# EAGLE design board (EAGLE 5.11)

## Sheet 1 of 4
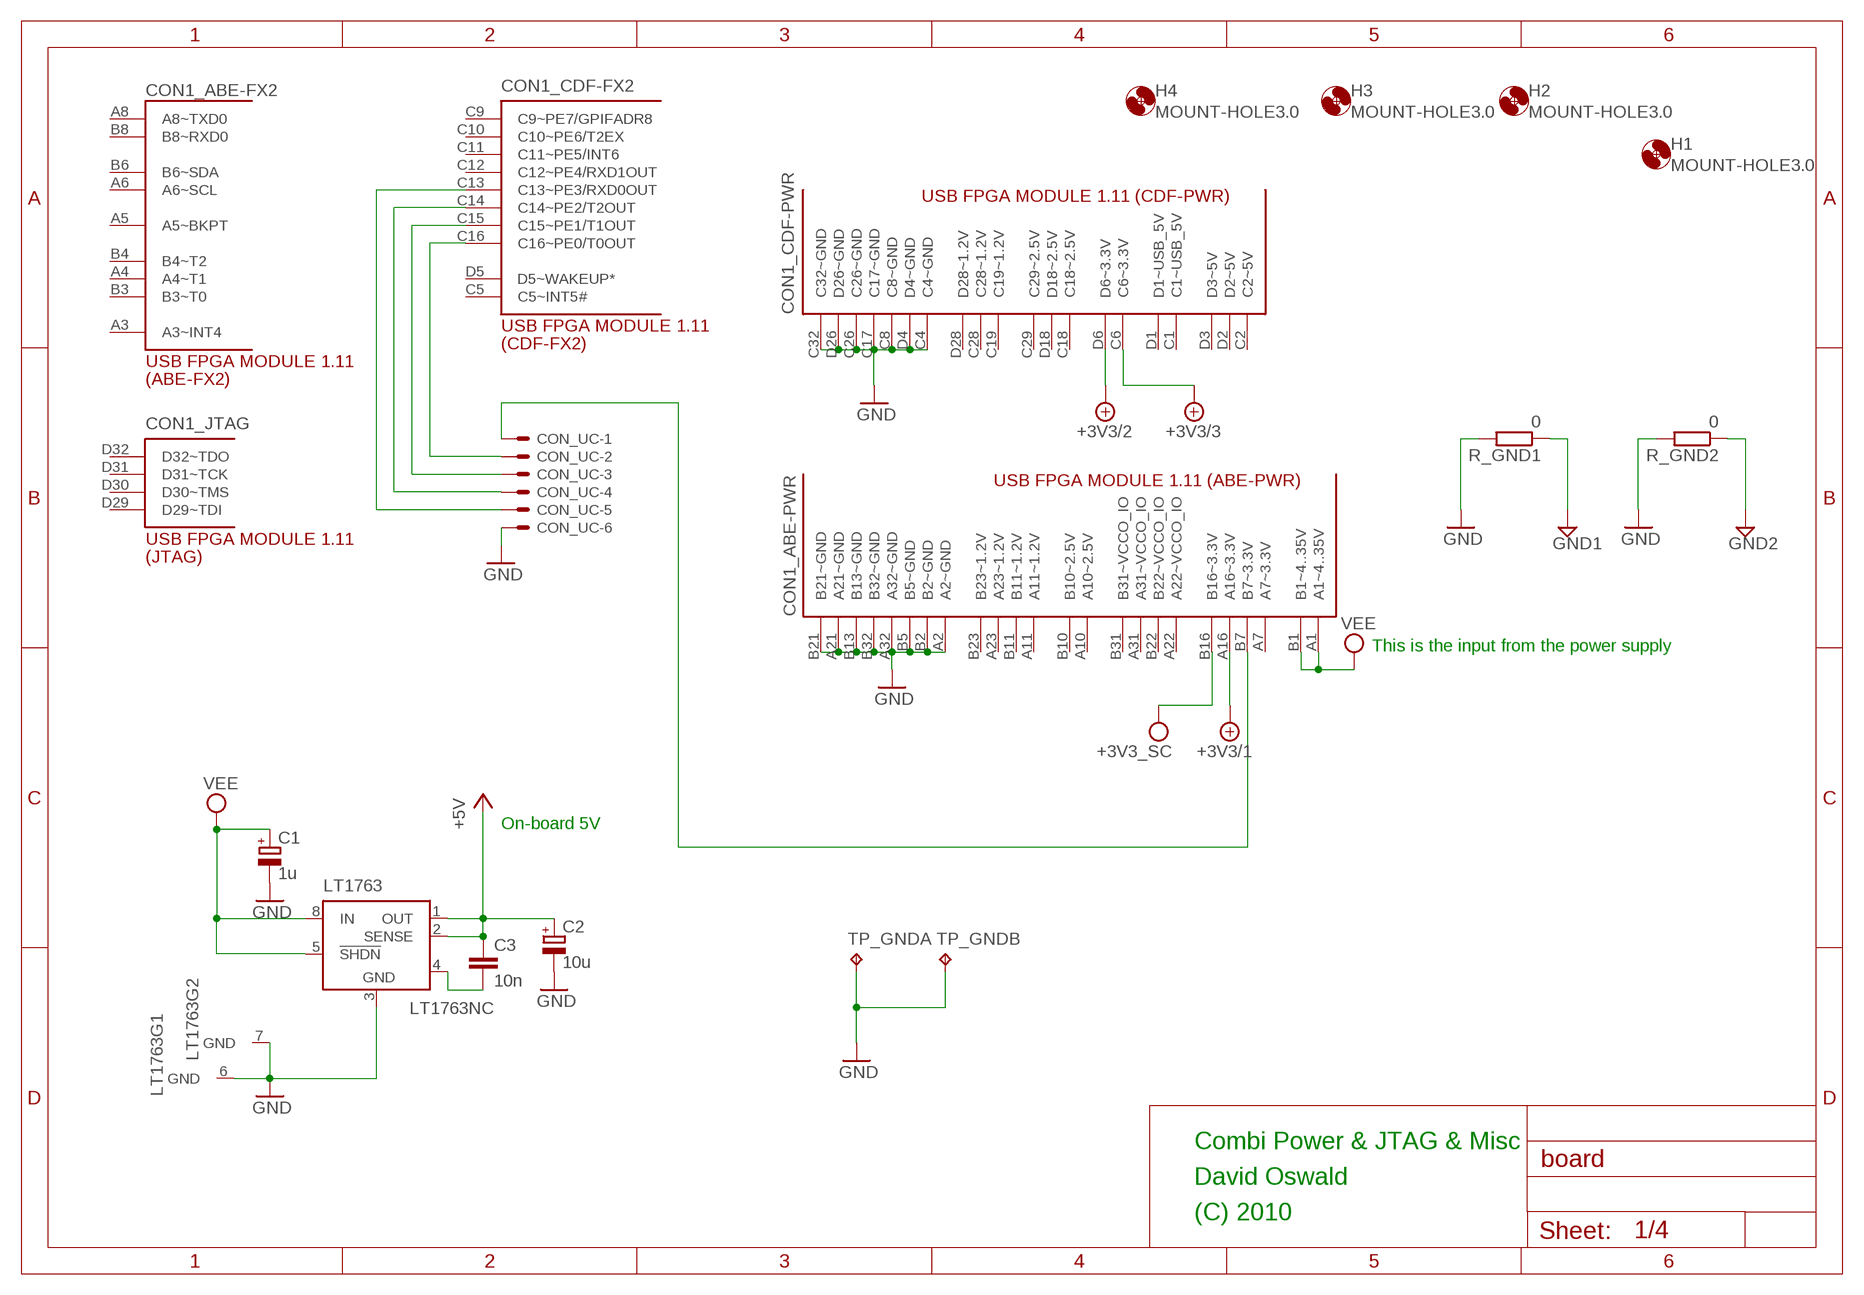
[diagram p0: schematic, sheet 1]

### Parts
C1  1u  CPOL-EUSMCC  [SMC_C]
C2  10u  CPOL-EUSMCC  [SMC_C]
C3  10n  C-EUC1206  [C1206]
CON1  USB-FPGA1.11  [USB-FPGA1.11]
CON_UC  22-23-2061  [22-23-2061]
H1  MOUNT-HOLE3.0  [3,0]
H2  MOUNT-HOLE3.0  [3,0]
H3  MOUNT-HOLE3.0  [3,0]
H4  MOUNT-HOLE3.0  [3,0]
LT1763  LT1129CS8  [SOIC8]
R_GND1  0  R-EU_R1206  [R1206]
R_GND2  0  R-EU_R1206  [R1206]
TP_GNDA  TPPAD1-13  [P1-13]
TP_GNDB  TPPAD1-13  [P1-13]

### Nets
+5V: C2.+ C3.1 LT1763.1(OUT) LT1763.2(SENSE) ; also sheet 2
+5V/1: CON1.A16(_ABE-PWR:A16~3.3V) ; supply symbol labelled +3V3/1 ; also sheet 2
+5V/2: CON1.D6(_CDF-PWR:D6~3.3V) ; supply symbol labelled +3V3/2 ; also sheet 3
+5V/3: CON1.C6(_CDF-PWR:C6~3.3V) ; supply symbol labelled +3V3/3 ; also sheet 3
GND: C1.- C2.- CON1.A2(_ABE-PWR:A2~GND) CON1.A21(_ABE-PWR:A21~GND) CON1.A32(_ABE-PWR:A32~GND) CON1.B2(_ABE-PWR:B2~GND) CON1.B5(_ABE-PWR:B5~GND) CON1.B13(_ABE-PWR:B13~GND) CON1.B21(_ABE-PWR:B21~GND) CON1.B32(_ABE-PWR:B32~GND) CON1.C4(_CDF-PWR:C4~GND) CON1.C8(_CDF-PWR:C8~GND) CON1.C17(_CDF-PWR:C17~GND) CON1.C26(_CDF-PWR:C26~GND) CON1.C32(_CDF-PWR:C32~GND) CON1.D4(_CDF-PWR:D4~GND) CON1.D26(_CDF-PWR:D26~GND) CON_UC.6 LT1763.3(GND) LT1763.6(GND) LT1763.7(GND) R_GND1.2 R_GND2.2 TP_GNDA.TP TP_GNDB.TP ; also sheet 2,3,4
GND1: R_GND1.1 ; also sheet 2
GND2: R_GND2.1 ; also sheet 3
N$7: C3.2 LT1763.4(NC)
N$58: CON1.B7(_ABE-PWR:B7~3.3V) CON_UC.1
N$60: CON1.C13(_CDF-FX2:C13~PE3/RXD0OUT) CON_UC.5
N$61: CON1.C14(_CDF-FX2:C14~PE2/T2OUT) CON_UC.4
N$62: CON1.C15(_CDF-FX2:C15~PE1/T1OUT) CON_UC.3
N$63: CON1.C16(_CDF-FX2:C16~PE0/T0OUT) CON_UC.2
VEE: C1.+ CON1.A1(_ABE-PWR:A1~4..35V) CON1.B1(_ABE-PWR:B1~4..35V) LT1763.5(!SHDN) LT1763.8(IN)
VPP: CON1.B16(_ABE-PWR:B16~3.3V) ; supply symbol labelled +3V3_SC ; also sheet 4
Unconnected: CON1.A3(_ABE-FX2:A3~INT4) CON1.A4(_ABE-FX2:A4~T1) CON1.A5(_ABE-FX2:A5~BKPT) CON1.A6(_ABE-FX2:A6~SCL) CON1.A7(_ABE-PWR:A7~3.3V) CON1.A8(_ABE-FX2:A8~TXD0) CON1.A10(_ABE-PWR:A10~2.5V) CON1.A11(_ABE-PWR:A11~1.2V) CON1.A22(_ABE-PWR:A22~VCCO_IO) CON1.A23(_ABE-PWR:A23~1.2V) CON1.A31(_ABE-PWR:A31~VCCO_IO) CON1.B3(_ABE-FX2:B3~T0) CON1.B4(_ABE-FX2:B4~T2) CON1.B6(_ABE-FX2:B6~SDA) CON1.B8(_ABE-FX2:B8~RXD0) CON1.B10(_ABE-PWR:B10~2.5V) CON1.B11(_ABE-PWR:B11~1.2V) CON1.B22(_ABE-PWR:B22~VCCO_IO) CON1.B23(_ABE-PWR:B23~1.2V) CON1.B31(_ABE-PWR:B31~VCCO_IO) CON1.C1(_CDF-PWR:C1~USB_5V) CON1.C2(_CDF-PWR:C2~5V) CON1.C5(_CDF-FX2:C5~INT5#) CON1.C9(_CDF-FX2:C9~PE7/GPIFADR8) CON1.C10(_CDF-FX2:C10~PE6/T2EX) CON1.C11(_CDF-FX2:C11~PE5/INT6) CON1.C12(_CDF-FX2:C12~PE4/RXD1OUT) CON1.C18(_CDF-PWR:C18~2.5V) CON1.C19(_CDF-PWR:C19~1.2V) CON1.C28(_CDF-PWR:C28~1.2V) CON1.C29(_CDF-PWR:C29~2.5V) CON1.D1(_CDF-PWR:D1~USB_5V) CON1.D2(_CDF-PWR:D2~5V) CON1.D3(_CDF-PWR:D3~5V) CON1.D5(_CDF-FX2:D5~WAKEUP*) CON1.D18(_CDF-PWR:D18~2.5V) CON1.D28(_CDF-PWR:D28~1.2V) CON1.D29(_JTAG:D29~TDI) CON1.D30(_JTAG:D30~TMS) CON1.D31(_JTAG:D31~TCK) CON1.D32(_JTAG:D32~TDO)

### Notes on the sheet
- This is the input from the power supply
- On-board 5V
- Combi Power & JTAG & Misc
- David Oswald
- (C) 2010

## Sheet 2 of 4
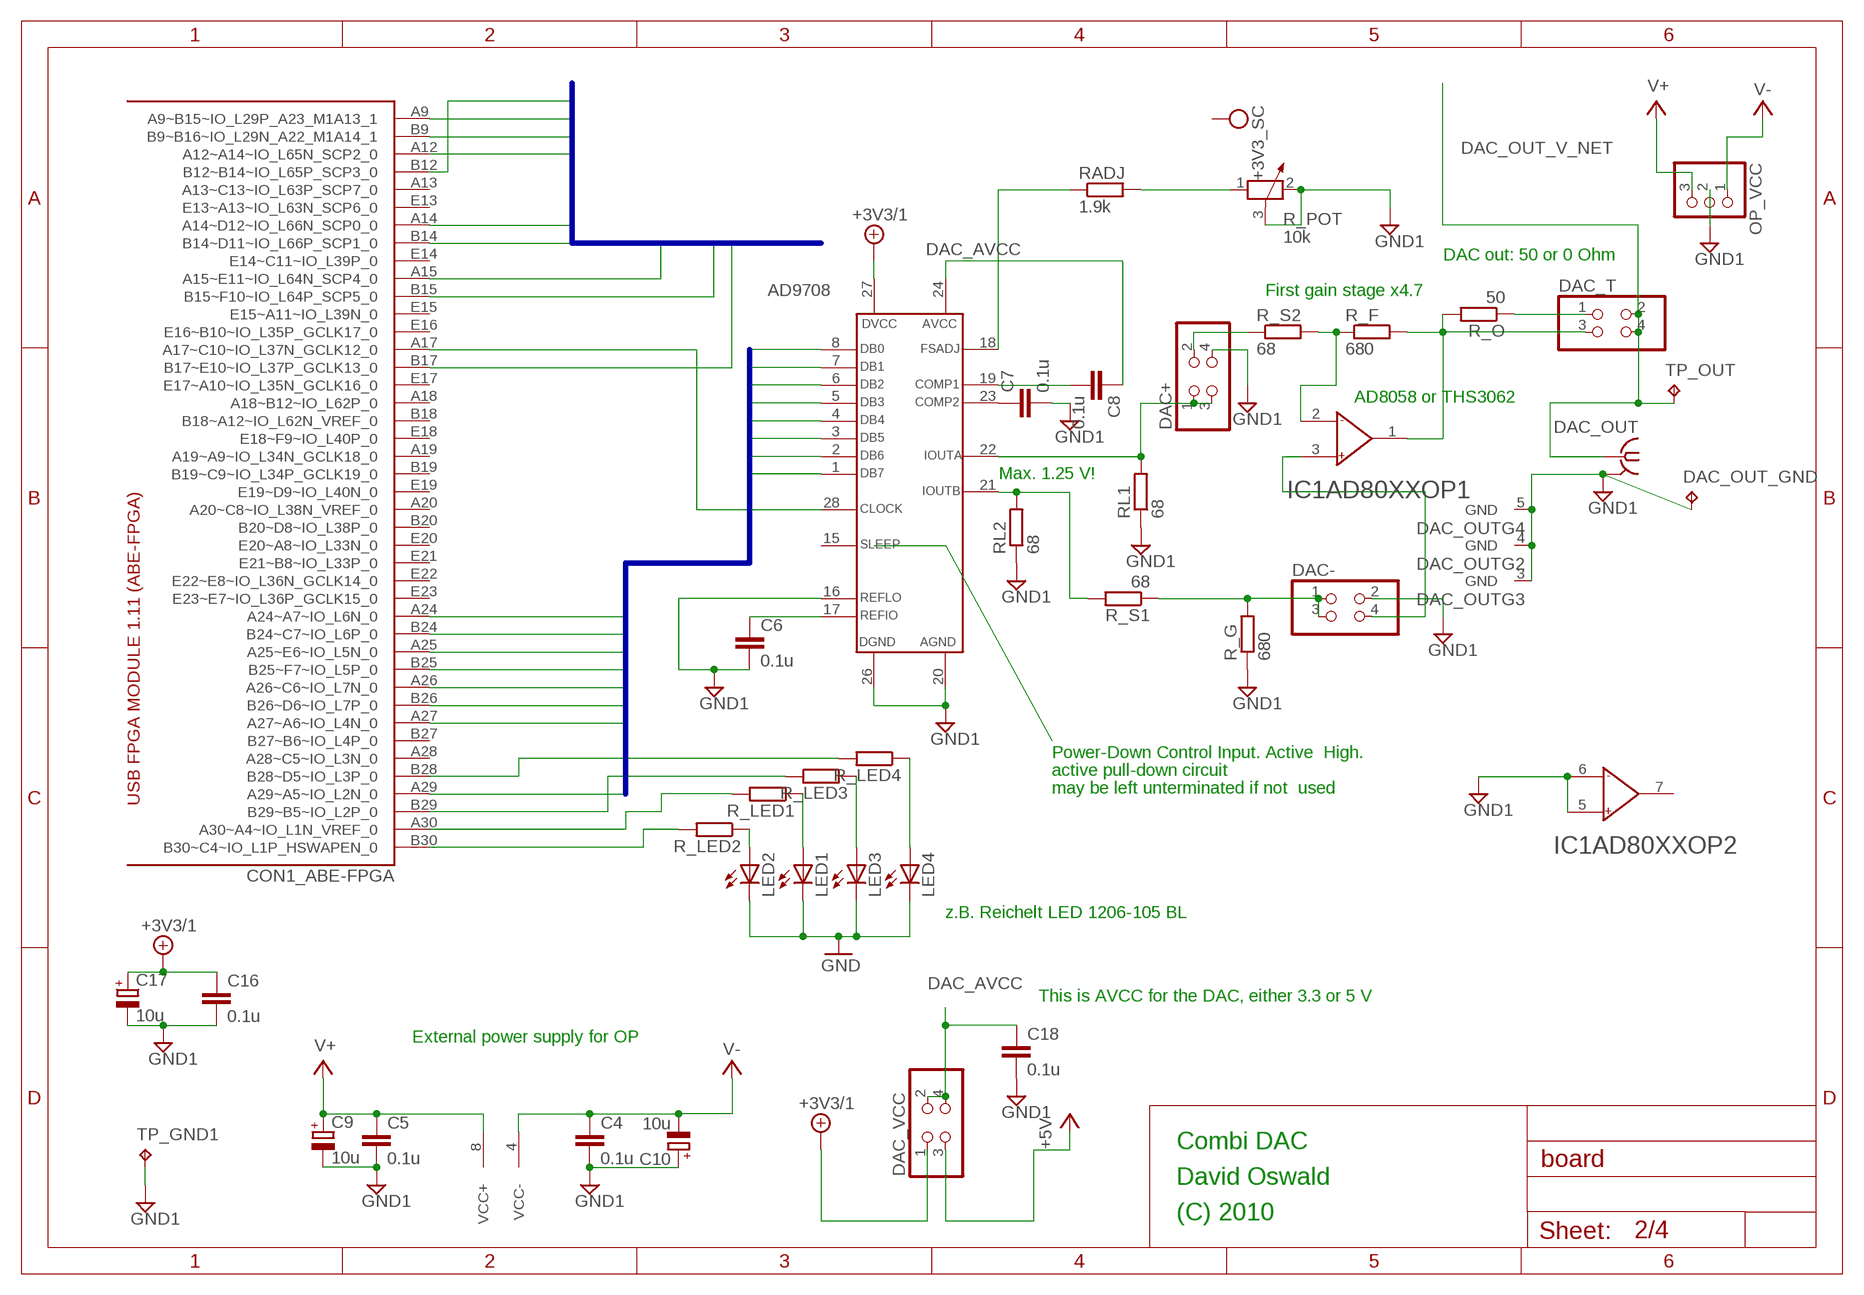
[diagram p1: schematic, sheet 2]

### Parts
AD9708  AD7908  [SO28W]
C4  0.1u  C-EUC1206  [C1206]
C5  0.1u  C-EUC1206  [C1206]
C6  0.1u  C-EUC1206  [C1206]
C7  0.1u  C-EUC1206  [C1206]
C8  0.1u  C-EUC1206  [C1206]
C9  10u  CPOL-EUSMCC  [SMC_C]
C10  10u  CPOL-EUSMCC  [SMC_C]
C16  0.1u  C-EUC1206  [C1206]
C17  10u  CPOL-EUSMCC  [SMC_C]
C18  0.1u  C-EUC1206  [C1206]
DAC+  PINHD-2X2  [2X02]
DAC-  PINHD-2X2  [2X02]
DAC_OUT  BU-SMA-V  [BU-SMA-V]
DAC_OUT_GND  TPPAD1-13  [P1-13]
DAC_T  PINHD-2X2  [2X02]
DAC_VCC  PINHD-2X2  [2X02]
IC1  AD80XX  [SO08]
LED1  LEDCHIPLED_1206  [CHIPLED_1206]
LED2  LEDCHIPLED_1206  [CHIPLED_1206]
LED3  LEDCHIPLED_1206  [CHIPLED_1206]
LED4  LEDCHIPLED_1206  [CHIPLED_1206]
OP_VCC  PINHD-1X3  [1X03]
R_F  680  R-EU_R1206  [R1206]
R_G  680  R-EU_R1206  [R1206]
R_LED1  R-EU_R1206  [R1206]
R_LED2  R-EU_R1206  [R1206]
R_LED3  R-EU_R1206  [R1206]
R_LED4  R-EU_R1206  [R1206]
R_O  50  R-EU_R1206  [R1206]
R_POT  10k  POTENTIOMETER_PT_SPIN  [PT-SPIN]
R_S1  68  R-EU_R1206  [R1206]
R_S2  68  R-EU_R1206  [R1206]
RADJ  1.9k  R-EU_R1206  [R1206]
RL1  68  R-EU_R1206  [R1206]
RL2  68  R-EU_R1206  [R1206]
TP_GND1  TPPAD1-13  [P1-13]
TP_OUT  TPPAD1-13  [P1-13]

### Nets
+5V: DAC_VCC.3 ; also sheet 1
+5V/1: AD9708.27(DVCC) C16.1 C17.+ DAC_VCC.1 ; supply symbol labelled +3V3/1 ; also sheet 1
CLK: AD9708.28(CLOCK) CON1.A17(_ABE-FPGA:A17~C10~IO_L37N_GCLK12_0)
CLK_SC: CON1.A15(_ABE-FPGA:A15~E11~IO_L64N_SCP4_0) ; also sheet 4
DAC_AVCC: AD9708.24(AVCC) C8.1 C18.1 DAC_VCC.2 DAC_VCC.4
DAC_OUT_V_NET: DAC_OUT.1 DAC_T.2 DAC_T.4 TP_OUT.TP ; also sheet 4
DB0: AD9708.8(DB0) CON1.A29(_ABE-FPGA:A29~A5~IO_L2N_0)
DB1: AD9708.7(DB1) CON1.A27(_ABE-FPGA:A27~A6~IO_L4N_0)
DB2: AD9708.6(DB2) CON1.B26(_ABE-FPGA:B26~D6~IO_L7P_0)
DB3: AD9708.5(DB3) CON1.A26(_ABE-FPGA:A26~C6~IO_L7N_0)
DB4: AD9708.4(DB4) CON1.A25(_ABE-FPGA:A25~E6~IO_L5N_0)
DB5: AD9708.3(DB5) CON1.B25(_ABE-FPGA:B25~F7~IO_L5P_0)
DB6: AD9708.2(DB6) CON1.A24(_ABE-FPGA:A24~A7~IO_L6N_0)
DB7: AD9708.1(DB7) CON1.B24(_ABE-FPGA:B24~C7~IO_L6P_0)
GND: LED1.C LED2.C LED3.C LED4.C ; also sheet 1,3,4
GND1: AD9708.16(REFLO) AD9708.20(AGND) AD9708.26(DGND) C4.2 C5.2 C6.2 C7.2 C9.- C10.+ C16.2 C17.- C18.2 DAC+.4 DAC-.2 DAC_OUT.2(GND) DAC_OUT.3(GND) DAC_OUT.4(GND) DAC_OUT.5(GND) IC1.5(AD80XXOP2:IN+) IC1.6(AD80XXOP2:IN-) OP_VCC.2 R_G.1 R_POT.2 R_POT.3 RL1.1 RL2.1 TP_GND1.TP ; also sheet 1
IO: CON1.B9(_ABE-FPGA:B9~B16~IO_L29N_A22_M1A14_1) ; also sheet 4
N$10: DAC-.1 DAC-.3 R_G.2 R_S1.1
N$11: IC1.2(AD80XXOP1:IN-) R_F.1 R_S2.2
N$12: DAC_T.3 IC1.1(AD80XXOP1:OUT) R_F.2 R_O.2
N$13: AD9708.17(REFIO) C6.1
N$14: AD9708.23(COMP2) C7.1
N$15: AD9708.19(COMP1) C8.2
N$16: AD9708.18(FSADJ) RADJ.1
N$17: DAC-.4 IC1.3(AD80XXOP1:IN+)
N$18: DAC_T.1 R_O.1
N$19: R_POT.1 RADJ.2
N$22: AD9708.21(IOUTB) R_S1.2 RL2.2
N$23: AD9708.22(IOUTA) DAC+.1 DAC+.3 RL1.2
N$24: DAC+.2 R_S2.1
N$34: LED2.A R_LED2.1
N$35: LED1.A R_LED1.1
N$50: LED3.A R_LED3.1
N$51: LED4.A R_LED4.1
N$52: DAC_OUT_GND.TP
N$53: CON1.B30(_ABE-FPGA:B30~C4~IO_L1P_HSWAPEN_0) R_LED2.2
N$54: CON1.A30(_ABE-FPGA:A30~A4~IO_L1N_VREF_0) R_LED1.2
N$55: CON1.B29(_ABE-FPGA:B29~B5~IO_L2P_0) R_LED3.2
N$56: CON1.B28(_ABE-FPGA:B28~D5~IO_L3P_0) R_LED4.2
PIN4: CON1.B14(_ABE-FPGA:B14~D11~IO_L66P_SCP1_0) ; also sheet 4
PIN6: CON1.A12(_ABE-FPGA:A12~A14~IO_L65N_SCP2_0) ; also sheet 4
PIN8: CON1.A9(_ABE-FPGA:A9~B15~IO_L29P_A23_M1A13_1) ; also sheet 4
RST: CON1.B15(_ABE-FPGA:B15~F10~IO_L64P_SCP5_0) ; also sheet 4
SHDN: CON1.B17(_ABE-FPGA:B17~E10~IO_L37P_GCLK13_0) ; also sheet 4
SW1: CON1.B12(_ABE-FPGA:B12~B14~IO_L65P_SCP3_0) ; also sheet 4
SW2: CON1.A14(_ABE-FPGA:A14~D12~IO_L66N_SCP0_0) ; also sheet 4
V+: C5.1 C9.+ IC1.8(SUPPLY:VCC+) OP_VCC.3
V-: C4.1 C10.- IC1.4(SUPPLY:VCC-) OP_VCC.1
Unconnected: AD9708.15(SLEEP) CON1.A13(_ABE-FPGA:A13~C13~IO_L63P_SCP7_0) CON1.A18(_ABE-FPGA:A18~B12~IO_L62P_0) CON1.A19(_ABE-FPGA:A19~A9~IO_L34N_GCLK18_0) CON1.A20(_ABE-FPGA:A20~C8~IO_L38N_VREF_0) CON1.A28(_ABE-FPGA:A28~C5~IO_L3N_0) CON1.B18(_ABE-FPGA:B18~A12~IO_L62N_VREF_0) CON1.B19(_ABE-FPGA:B19~C9~IO_L34P_GCLK19_0) CON1.B20(_ABE-FPGA:B20~D8~IO_L38P_0) CON1.B27(_ABE-FPGA:B27~B6~IO_L4P_0) CON1.E13(_ABE-FPGA:E13~A13~IO_L63N_SCP6_0) CON1.E14(_ABE-FPGA:E14~C11~IO_L39P_0) CON1.E15(_ABE-FPGA:E15~A11~IO_L39N_0) CON1.E16(_ABE-FPGA:E16~B10~IO_L35P_GCLK17_0) CON1.E17(_ABE-FPGA:E17~A10~IO_L35N_GCLK16_0) CON1.E18(_ABE-FPGA:E18~F9~IO_L40P_0) CON1.E19(_ABE-FPGA:E19~D9~IO_L40N_0) CON1.E20(_ABE-FPGA:E20~A8~IO_L33N_0) CON1.E21(_ABE-FPGA:E21~B8~IO_L33P_0) CON1.E22(_ABE-FPGA:E22~E8~IO_L36N_GCLK14_0) CON1.E23(_ABE-FPGA:E23~E7~IO_L36P_GCLK15_0) IC1.7(AD80XXOP2:OUT)

### Buses
DB0,DB1,DB2,DB3,DB4,DB5,DB6,DB7
SW1,SW2,PIN8,PIN4,IO,CLK_SC,PIN6,RST,SHDN

### Notes on the sheet
- DAC out: 50 or 0 Ohm
- First gain stage x4.7
- AD8058 or THS3062
- Max. 1.25 V!
- Power-Down Control Input. Active  High.
- active pull-down circuit
- may be left unterminated if not  used
- z.B. Reichelt LED 1206-105 BL
- This is AVCC for the DAC, either 3.3 or 5 V
- External power supply for OP
- Combi DAC
- David Oswald
- (C) 2010

## Sheet 3 of 4
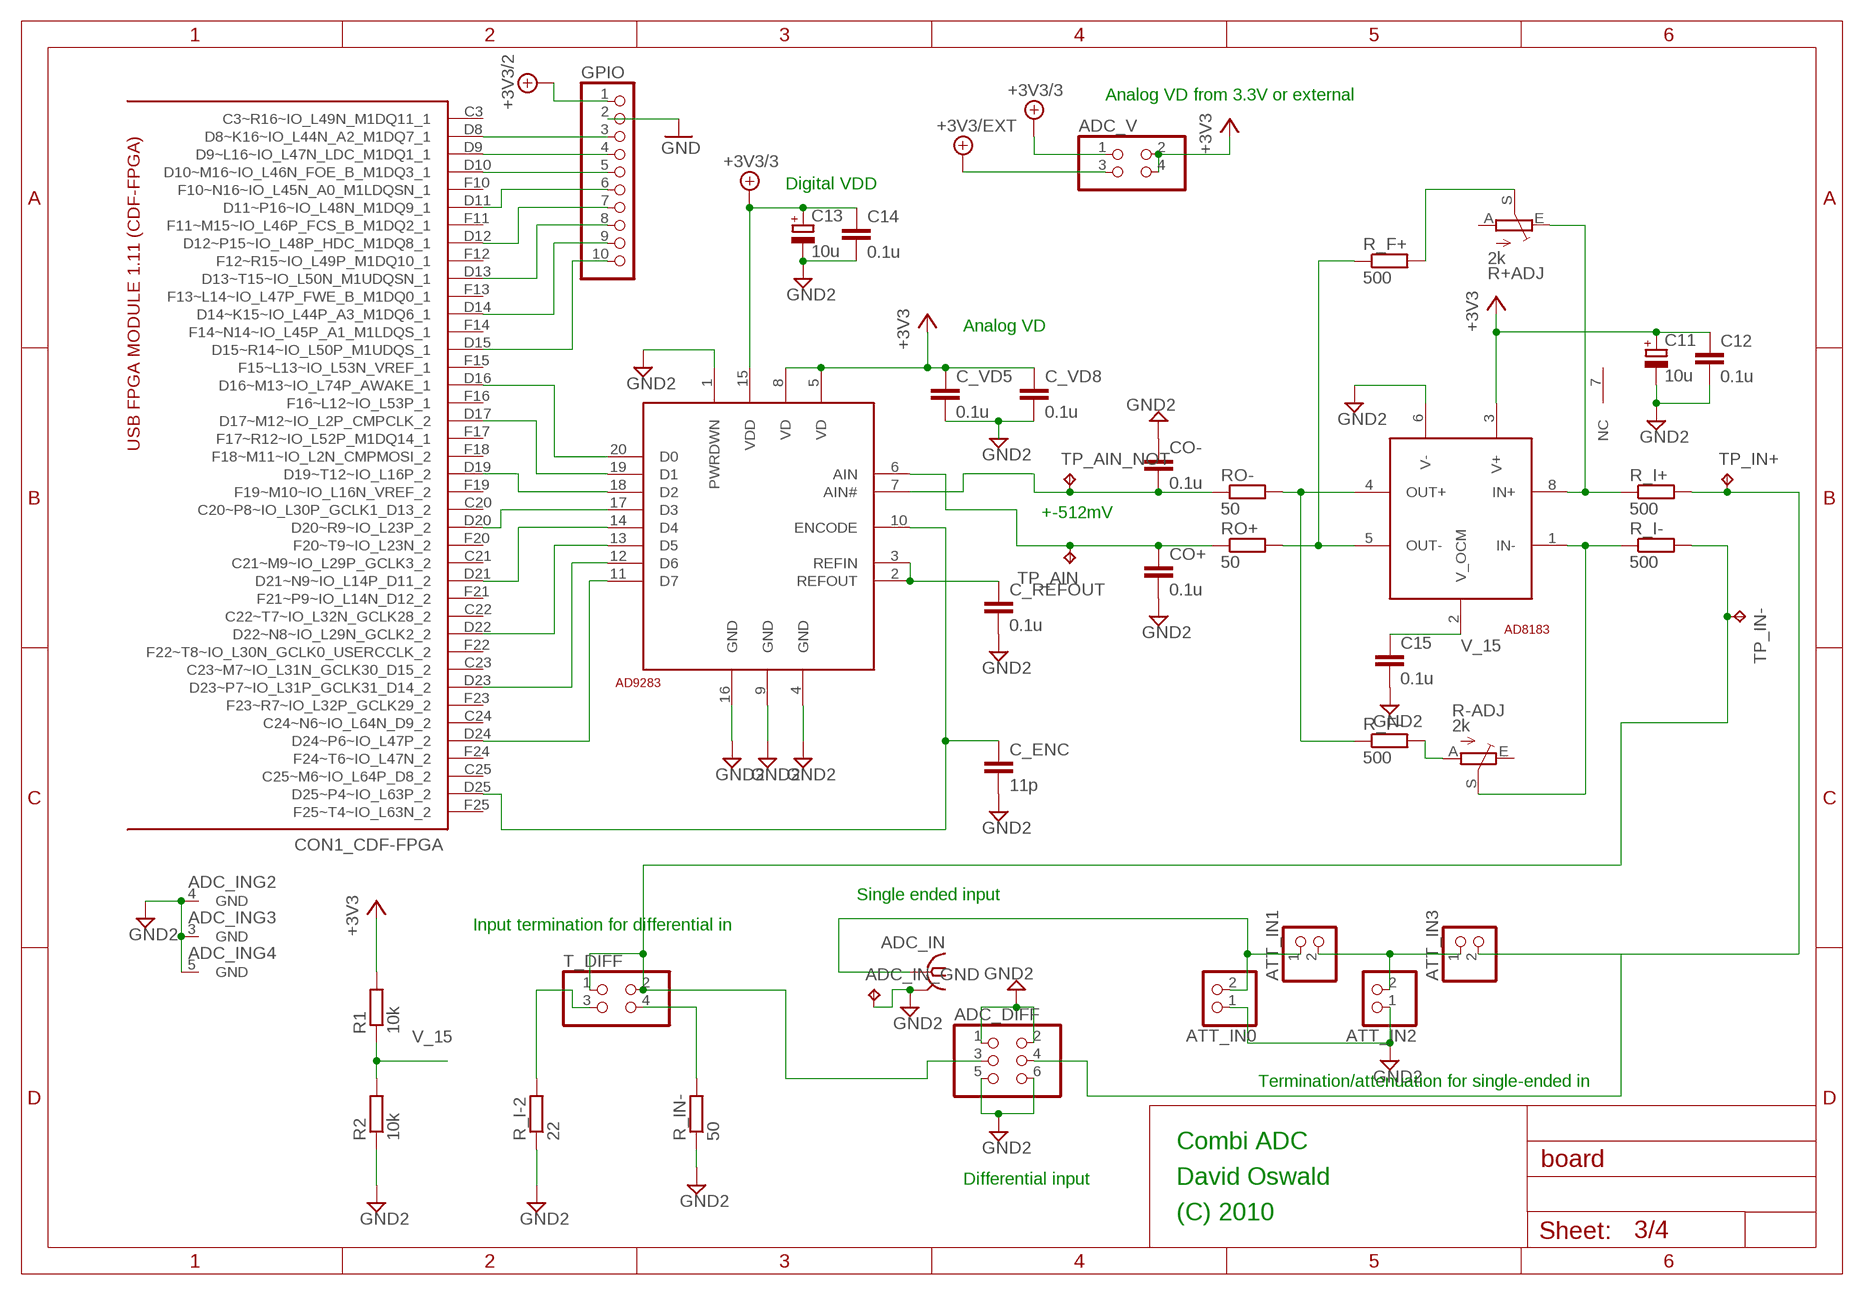
[diagram p2: schematic, sheet 3]

### Parts
AD8183  AD8138  [SOIC8]
AD9283  AD9283  [SSOP20]
ADC_DIFF  PINHD-2X3  [2X03]
ADC_IN  BU-SMA-V  [BU-SMA-V]
ADC_IN_GND  TPPAD1-13  [P1-13]
ADC_V  PINHD-2X2  [2X02]
ATT_IN0  PINHD-1X2  [1X02]
ATT_IN1  PINHD-1X2  [1X02]
ATT_IN2  PINHD-1X2  [1X02]
ATT_IN3  PINHD-1X2  [1X02]
C11  10u  CPOL-EUSMCC  [SMC_C]
C12  0.1u  C-EUC1206  [C1206]
C13  10u  CPOL-EUSMCC  [SMC_C]
C14  0.1u  C-EUC1206  [C1206]
C15  0.1u  C-EUC1206  [C1206]
C_ENC  11p  C-EUC1206  [C1206]
C_REFOUT  0.1u  C-EUC1206  [C1206]
C_VD5  0.1u  C-EUC1206  [C1206]
C_VD8  0.1u  C-EUC1206  [C1206]
CO+  0.1u  C-EUC1206  [C1206]
CO-  0.1u  C-EUC1206  [C1206]
GPIO  PINHD-1X10  [1X10]
R1  10k  R-EU_R1206  [R1206]
R2  10k  R-EU_R1206  [R1206]
R+ADJ  2k  TRIM_EU-B64Y  [B64Y]
R-ADJ  2k  TRIM_EU-B64Y  [B64Y]
R_F+  500  R-EU_R1206  [R1206]
R_F-  500  R-EU_R1206  [R1206]
R_I+  500  R-EU_R1206  [R1206]
R_I-  500  R-EU_R1206  [R1206]
R_I-2  22  R-EU_R1206  [R1206]
R_IN-  50  R-EU_R1206  [R1206]
RO+  50  R-EU_R1206  [R1206]
RO-  50  R-EU_R1206  [R1206]
T_DIFF  PINHD-2X2  [2X02]
TP_AIN  TPPAD1-13  [P1-13]
TP_AIN_NOT  TPPAD1-13  [P1-13]
TP_IN+  TPPAD1-13  [P1-13]
TP_IN-  TPPAD1-13  [P1-13]

### Nets
+3V3: AD8183.3(V+) AD9283.5(VD) AD9283.8(VD) ADC_V.2 ADC_V.4 C11.+ C12.1 C_VD5.1 C_VD8.1 R1.2
+5V/2: GPIO.1 ; supply symbol labelled +3V3/2 ; also sheet 1
+5V/3: AD9283.15(VDD) ADC_V.1 C13.+ C14.1 ; supply symbol labelled +3V3/3 ; also sheet 1
+5V/4: ADC_V.3 ; supply symbol labelled +3V3/EXT
ADC_AIN: AD9283.6(AIN) CO+.1 RO+.1 TP_AIN.TP
ADC_AIN_NOT: AD9283.7(AIN#) CO-.2 RO-.1 TP_AIN_NOT.TP
ADC_D0: AD9283.20(D0) CON1.D16(_CDF-FPGA:D16~M13~IO_L74P_AWAKE_1)
ADC_D1: AD9283.19(D1) CON1.D17(_CDF-FPGA:D17~M12~IO_L2P_CMPCLK_2)
ADC_D2: AD9283.18(D2) CON1.D19(_CDF-FPGA:D19~T12~IO_L16P_2)
ADC_D4: AD9283.14(D4) CON1.D21(_CDF-FPGA:D21~N9~IO_L14P_D11_2)
ADC_D5: AD9283.13(D5) CON1.D22(_CDF-FPGA:D22~N8~IO_L29N_GCLK2_2)
ADC_D6: AD9283.12(D6) CON1.D23(_CDF-FPGA:D23~P7~IO_L31P_GCLK31_D14_2)
ADC_D7: AD9283.11(D7) CON1.D24(_CDF-FPGA:D24~P6~IO_L47P_2)
ADC_ENCODE: AD9283.10(ENCODE) C_ENC.1 CON1.D25(_CDF-FPGA:D25~P4~IO_L63P_2)
GND: GPIO.2 ; also sheet 1,2,4
GND2: AD8183.6(V-) AD9283.1(PWRDWN) AD9283.4(GND) AD9283.9(GND) AD9283.16(GND) ADC_DIFF.1 ADC_DIFF.2 ADC_DIFF.5 ADC_DIFF.6 ADC_IN.2(GND) ADC_IN.3(GND) ADC_IN.4(GND) ADC_IN.5(GND) ADC_IN_GND.TP ATT_IN0.1 ATT_IN2.1 C11.- C12.2 C13.- C14.2 C15.2 C_ENC.2 C_REFOUT.2 C_VD5.2 C_VD8.2 CO+.2 CO-.1 R2.1 R_I-2.1 R_IN-.1 ; also sheet 1
N$25: CON1.D8(_CDF-FPGA:D8~K16~IO_L44N_A2_M1DQ7_1) GPIO.3
N$26: CON1.D9(_CDF-FPGA:D9~L16~IO_L47N_LDC_M1DQ1_1) GPIO.4
N$27: CON1.D10(_CDF-FPGA:D10~M16~IO_L46N_FOE_B_M1DQ3_1) GPIO.5
N$28: CON1.D11(_CDF-FPGA:D11~P16~IO_L48N_M1DQ9_1) GPIO.6
N$29: CON1.D12(_CDF-FPGA:D12~P15~IO_L48P_HDC_M1DQ8_1) GPIO.7
N$30: CON1.D13(_CDF-FPGA:D13~T15~IO_L50N_M1UDQSN_1) GPIO.8
N$31: CON1.D14(_CDF-FPGA:D14~K15~IO_L44P_A3_M1DQ6_1) GPIO.9
N$32: CON1.D15(_CDF-FPGA:D15~R14~IO_L50P_M1UDQS_1) GPIO.10
N$33: AD9283.2(REFOUT) AD9283.3(REFIN) C_REFOUT.1
N$36: AD8183.8(IN+) R+ADJ.E R_I+.1
N$37: AD8183.1(IN-) R-ADJ.S R_I-.1
N$38: ATT_IN1.2 ATT_IN2.2 ATT_IN3.1
N$39: ADC_DIFF.3 R_I-.2 T_DIFF.1 T_DIFF.2 TP_IN-.TP
N$40: R_I-2.2 T_DIFF.3
N$41: R_IN-.2 T_DIFF.4
N$42: ADC_DIFF.4 ATT_IN3.2 R_I+.2 TP_IN+.TP
N$43: R-ADJ.A R_F-.2
N$44: R+ADJ.S R_F+.2
N$45: AD8183.5(OUT-) R_F+.1 RO+.2
N$46: AD8183.4(OUT+) R_F-.1 RO-.2
N$49: AD9283.17(D3) CON1.D20(_CDF-FPGA:D20~R9~IO_L23P_2)
N$68: ADC_IN.1 ATT_IN0.2 ATT_IN1.1
V_15: AD8183.2(V_OCM) C15.1 R1.1 R2.2
Unconnected: AD8183.7(NC) CON1.C3(_CDF-FPGA:C3~R16~IO_L49N_M1DQ11_1) CON1.C20(_CDF-FPGA:C20~P8~IO_L30P_GCLK1_D13_2) CON1.C21(_CDF-FPGA:C21~M9~IO_L29P_GCLK3_2) CON1.C22(_CDF-FPGA:C22~T7~IO_L32N_GCLK28_2) CON1.C23(_CDF-FPGA:C23~M7~IO_L31N_GCLK30_D15_2) CON1.C24(_CDF-FPGA:C24~N6~IO_L64N_D9_2) CON1.C25(_CDF-FPGA:C25~M6~IO_L64P_D8_2) CON1.F10(_CDF-FPGA:F10~N16~IO_L45N_A0_M1LDQSN_1) CON1.F11(_CDF-FPGA:F11~M15~IO_L46P_FCS_B_M1DQ2_1) CON1.F12(_CDF-FPGA:F12~R15~IO_L49P_M1DQ10_1) CON1.F13(_CDF-FPGA:F13~L14~IO_L47P_FWE_B_M1DQ0_1) CON1.F14(_CDF-FPGA:F14~N14~IO_L45P_A1_M1LDQS_1) CON1.F15(_CDF-FPGA:F15~L13~IO_L53N_VREF_1) CON1.F16(_CDF-FPGA:F16~L12~IO_L53P_1) CON1.F17(_CDF-FPGA:F17~R12~IO_L52P_M1DQ14_1) CON1.F18(_CDF-FPGA:F18~M11~IO_L2N_CMPMOSI_2) CON1.F19(_CDF-FPGA:F19~M10~IO_L16N_VREF_2) CON1.F20(_CDF-FPGA:F20~T9~IO_L23N_2) CON1.F21(_CDF-FPGA:F21~P9~IO_L14N_D12_2) CON1.F22(_CDF-FPGA:F22~T8~IO_L30N_GCLK0_USERCCLK_2) CON1.F23(_CDF-FPGA:F23~R7~IO_L32P_GCLK29_2) CON1.F24(_CDF-FPGA:F24~T6~IO_L47N_2) CON1.F25(_CDF-FPGA:F25~T4~IO_L63N_2) R+ADJ.A R-ADJ.E

### Notes on the sheet
- Analog VD from 3.3V or external
- Digital VDD
- Analog VD
- +-512mV
- Single ended input
- Input termination for differential in
- Termination/attenuation for single-ended in
- Combi ADC
- Differential input | David Oswald
- (C) 2010

## Sheet 4 of 4
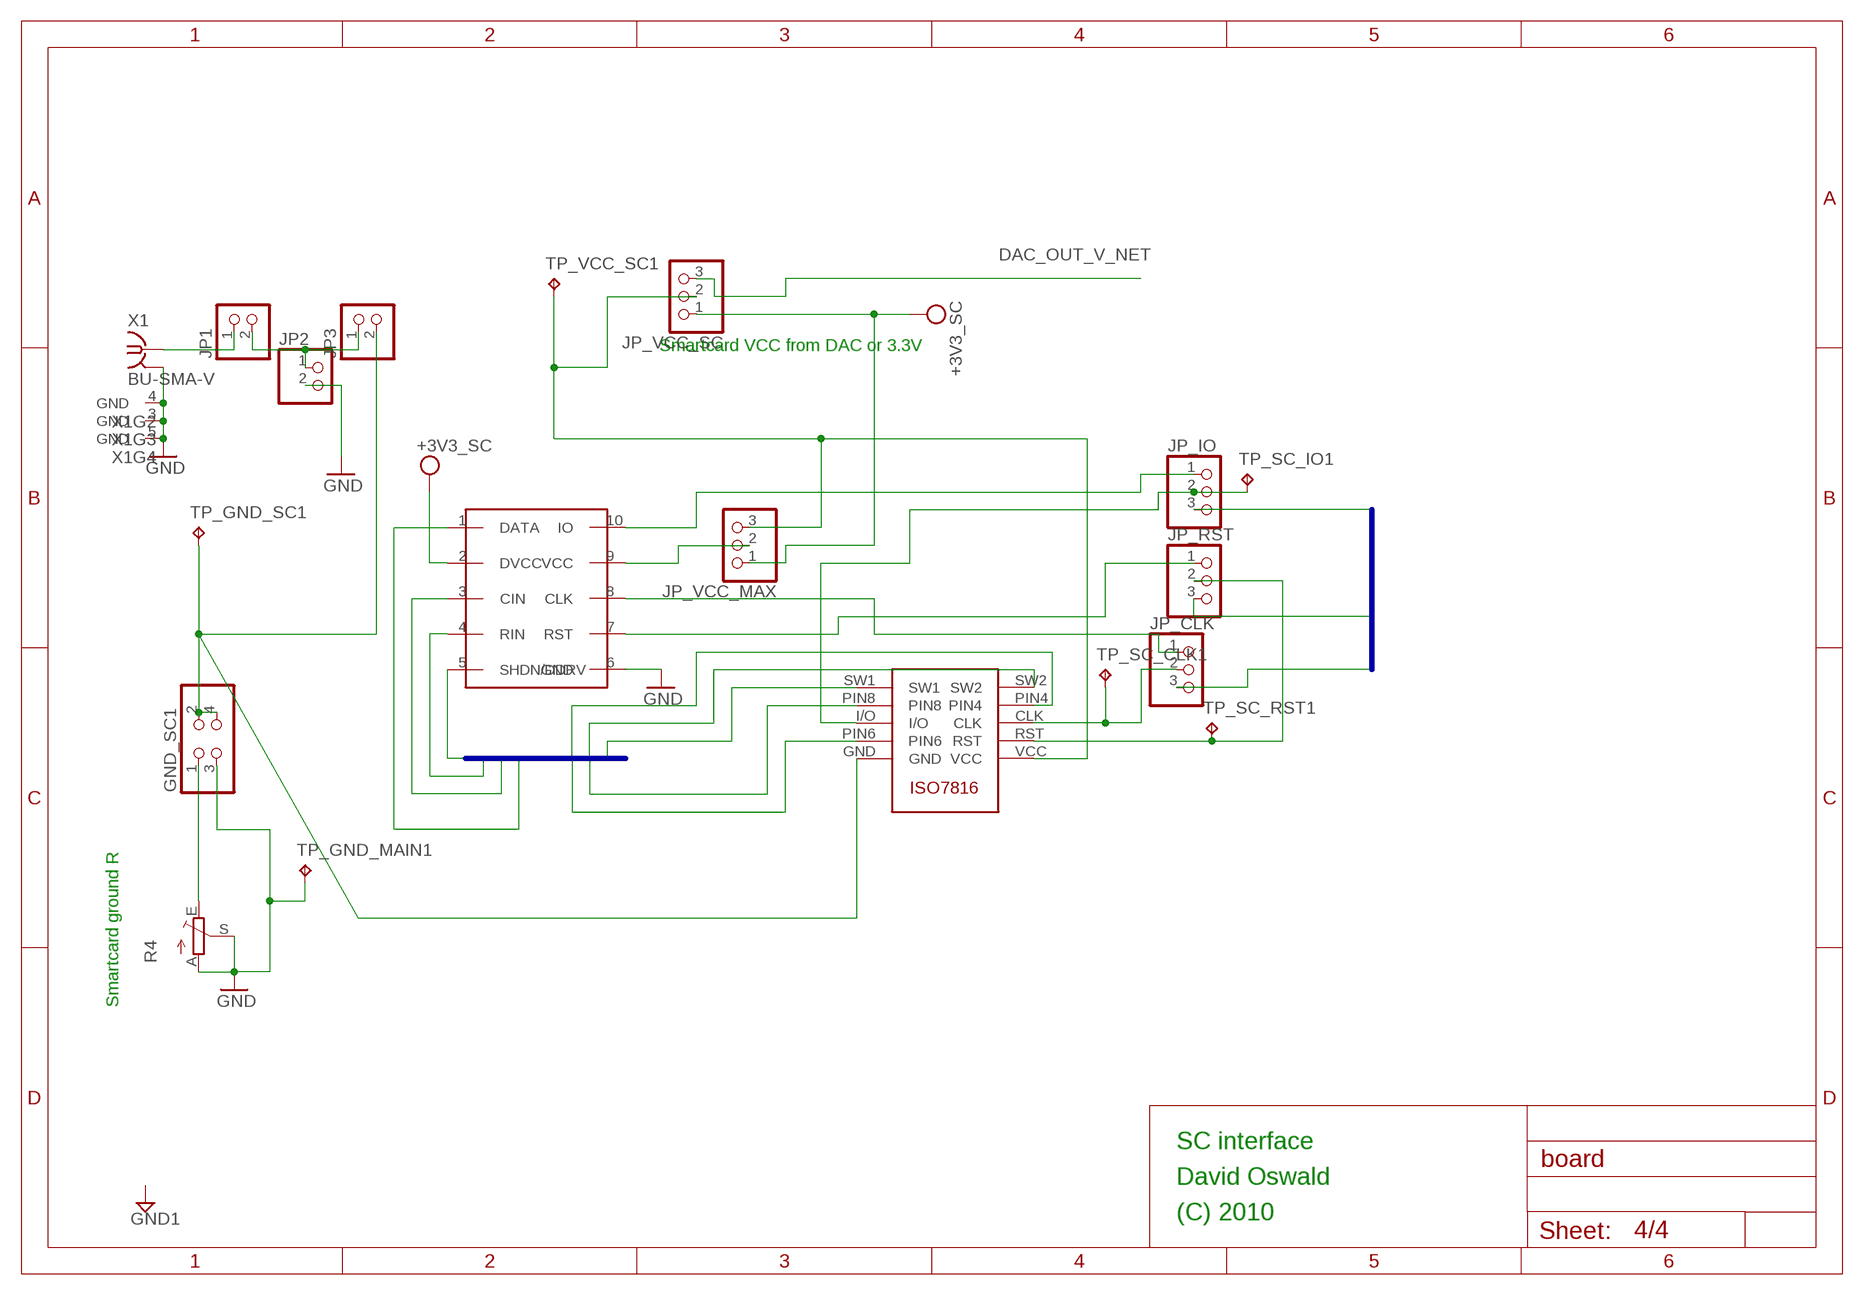
[diagram p3: schematic, sheet 4]

### Parts
GND_SC1  PINHD-2X2  [2X02]
IC_SC  MAX1840  [UMAX10]
JP1  PINHD-1X2  [1X02]
JP2  PINHD-1X2  [1X02]
JP3  PINHD-1X2  [1X02]
JP_CLK  PINHD-1X3  [1X03]
JP_IO  PINHD-1X3  [1X03]
JP_RST  PINHD-1X3  [1X03]
JP_VCC_MAX  PINHD-1X3  [1X03]
JP_VCC_SC  PINHD-1X3  [1X03]
R4  TRIM_EU-B64Y  [B64Y]
TP_GND_MAIN1  TPPAD1-13  [P1-13]
TP_GND_SC1  TPPAD1-13  [P1-13]
TP_SC_CLK1  TPPAD1-13  [P1-13]
TP_SC_IO1  TPPAD1-13  [P1-13]
TP_SC_RST1  TPPAD1-13  [P1-13]
TP_VCC_SC1  TPPAD1-13  [P1-13]
U$2  ISO7816-SMARTCARD  [CARDSOCKET]
X1  BU-SMA-V  [BU-SMA-V]

### Nets
CLK_SC: IC_SC.3(CIN) JP_CLK.3 ; also sheet 2
DAC_OUT_V_NET: JP_VCC_SC.3 ; also sheet 2
GND: GND_SC1.3 IC_SC.6(GND) JP2.2 R4.A R4.S TP_GND_MAIN1.TP X1.2(GND) X1.3(GND) X1.4(GND) X1.5(GND) ; also sheet 1,2,3
GND_SMARTCARD1: GND_SC1.2 GND_SC1.4 JP3.2 TP_GND_SC1.TP U$2.GND
IO: IC_SC.1(DATA) JP_IO.3 ; also sheet 2
N$20: IC_SC.9(VCC) JP_VCC_MAX.2
N$47: IC_SC.8(CLK) JP_CLK.1
N$57: JP_VCC_MAX.3 JP_VCC_SC.2 TP_VCC_SC1.TP U$2.VCC
N$59: IC_SC.10(IO) JP_IO.1
N$64: GND_SC1.1 R4.E
N$65: IC_SC.7(RST) JP_RST.1
N$66: JP1.1 X1.1
N$67: JP1.2 JP2.1 JP3.1
PIN4: U$2.PIN4 ; also sheet 2
PIN6: U$2.PIN6 ; also sheet 2
PIN8: U$2.PIN8 ; also sheet 2
RST: IC_SC.4(RIN) JP_RST.3 ; also sheet 2
SC_CLK_PIN: JP_CLK.2 TP_SC_CLK1.TP U$2.CLK
SC_IO_PIN: JP_IO.2 TP_SC_IO1.TP U$2.I/O
SC_RST_PIN: JP_RST.2 TP_SC_RST1.TP U$2.RST
SHDN: IC_SC.5(SHDN/DDRV) ; also sheet 2
SW1: U$2.SW1 ; also sheet 2
SW2: U$2.SW2 ; also sheet 2
VPP: IC_SC.2(DVCC) JP_VCC_MAX.1 JP_VCC_SC.1 ; supply symbol labelled +3V3_SC ; also sheet 1

### Buses
SW1,SW2,PIN8,PIN4,IO,CLK_SC,PIN6,RST,SHDN

### Notes on the sheet
- Smartcard VCC from DAC or 3.3V
- Smartcard ground R
- SC interface
- David Oswald
- (C) 2010

## Library data of the parts
AD8183 = ad8138:AD8138
AD9283 = ad9283:AD9283
AD9708 = ad9708:AD7908: AD9708 8-Bit DAC with current output http://www.analog.com/static/imported-files/data_sheets/AD9708.pdf
ADC_DIFF = pinhead:PINHD-2X3: PIN HEADER
ADC_IN DAC_OUT X1 = con-coax:BU-SMA-V: FEMALE SMA CONNECTOR Radiall distributor RS 112-3794; OC_FARNELL: unknown; OC_NEWARK: unknown
ADC_IN_GND DAC_OUT_GND TP_AIN TP_AIN_NOT TP_GND1 TP_GND_MAIN1 TP_GND_SC1 TP_GNDA TP_GNDB TP_IN+ TP_IN- TP_OUT TP_SC_CLK1 TP_SC_IO1 TP_SC_RST1 TP_VCC_SC1 = testpad:TP: Test pad
ADC_V DAC+ DAC- DAC_T DAC_VCC GND_SC1 T_DIFF = pinhead:PINHD-2X2: PIN HEADER
ATT_IN0 ATT_IN1-ATT_IN3 JP1-JP3 = pinhead:PINHD-1X2: PIN HEADER
C1 C2 C9-C11 C13 C17 = rcl:CPOL-EU: POLARIZED CAPACITOR, European symbol
C3-C8 C12 C14-C16 C18 C_ENC C_REFOUT C_VD5 C_VD8 CO+ CO- = rcl:C-EU: CAPACITOR, European symbol
CON1 = usb-fpga-1:USB-FPGA1.11
CON_UC = con-molex:22-23-2061: .100" (2.54mm) Center Header - 6 Pin
GPIO = pinhead:PINHD-1X10: PIN HEADER
H1-H4 = holes:MOUNT-HOLE: MOUNTING HOLE with drill center marker
IC1 = ad80xx:AD80XX: AD high bandwidth dual opamp
IC_SC = myMAXIM:MAX1840
JP_CLK JP_IO JP_RST JP_VCC_MAX JP_VCC_SC OP_VCC = pinhead:PINHD-1X3: PIN HEADER
LED1-LED4 = led:LED: LED OSRAM: - CHIPLED LG R971, LG N971, LY N971, LG Q971, LY Q971, LO R971, LY R971 LH N974, LH R974 LS Q976, LO Q976, LY Q976 LO Q996 - Hyper CHIPLED LW Q18S LB Q993, LB Q99A, LB R99A - SideLED LS A670, LO A670, LY A670, LG A670, LP A670 LB A673, LV A673, LT A673, LW A673 LH A674 LY A675 LS A676, LA A676, LO A676, LY A676, LW A676 LS A679, LY A679, LG A679 - Hyper Micro SIDELED® LS Y876, LA Y876, LO Y876, LY Y876 LT Y87S - SmartLED LW L88C, LW L88S LB L89C, LB L89S, LG L890 LS L89K, LO L89K, LY L89K LS L896, LA L896, LO L896, LY L896 - TOPLED LS T670, LO T670, LY T670, LG T670, LP T670 LSG T670, LSP T670, LSY T670, LOP T670, LYG T670 LG T671, LOG T671, LSG T671 LB T673, LV T673, LT T673, LW T673 LH T674 LS T676, LA T676, LO T676, LY T676, LB T676, LH T676, LSB T676, LW T676 LB T67C, LV T67C, LT T67C, LS T67K, LO T67K, LY T67K, LW E67C LS E67B, LA E67B, LO E67B, LY E67B, LB E67C, LV E67C, LT E67C LW T67C LS T679, LY T679, LG T679 LS T770, LO T770, LY T770, LG T770, LP T770 LB T773, LV T773, LT T773, LW T773 LH T774 LS E675, LA E675, LY E675, LS T675 LS T776, LA T776, LO T776, LY T776, LB T776 LHGB T686 LT T68C, LB T68C - Hyper Mini TOPLED® LB M676 - Mini TOPLED Santana® LG M470 LS M47K, LO M47K, LY M47K Source: http://www.osram.convergy.de LUXEON: - LUMILED® LXK2-PW12-R00, LXK2-PW12-S00, LXK2-PW14-U00, LXK2-PW14-V00 LXK2-PM12-R00, LXK2-PM12-S00, LXK2-PM14-U00 LXK2-PE12-Q00, LXK2-PE12-R00, LXK2-PE12-S00, LXK2-PE14-T00, LXK2-PE14-U00 LXK2-PB12-K00, LXK2-PB12-L00, LXK2-PB12-M00, LXK2-PB14-N00, LXK2-PB14-P00, LXK2-PB14-Q00 LXK2-PR12-L00, LXK2-PR12-M00, LXK2-PR14-Q00, LXK2-PR14-R00 LXK2-PD12-Q00, LXK2-PD12-R00, LXK2-PD12-S00 LXK2-PH12-R00, LXK2-PH12-S00 LXK2-PL12-P00, LXK2-PL12-Q00, LXK2-PL12-R00 Source: www.luxeon.com KINGBRIGHT: KA-3528ASYC Source: www.kingbright.com
LT1763 = linear-technology:LT1129CS8: VOLTAGE REGULATOR with shutdown
R1 R2 R_F R_F+ R_F- R_G R_GND1 R_GND2 R_I+ R_I- R_I-2 R_IN- R_LED1-R_LED4 R_O R_S1 R_S2 RADJ RL1 RL2 RO+ RO- = rcl:R-EU_: RESISTOR, European symbol
R4 R+ADJ R-ADJ = pot:TRIM_EU-: POTENTIOMETER
R_POT = rcl:POTENTIOMETER_: Potentiometer
U$2 = smartcard:ISO7816-SMARTCARD: ISO 7816 SmartCard and CardSocket

## Board
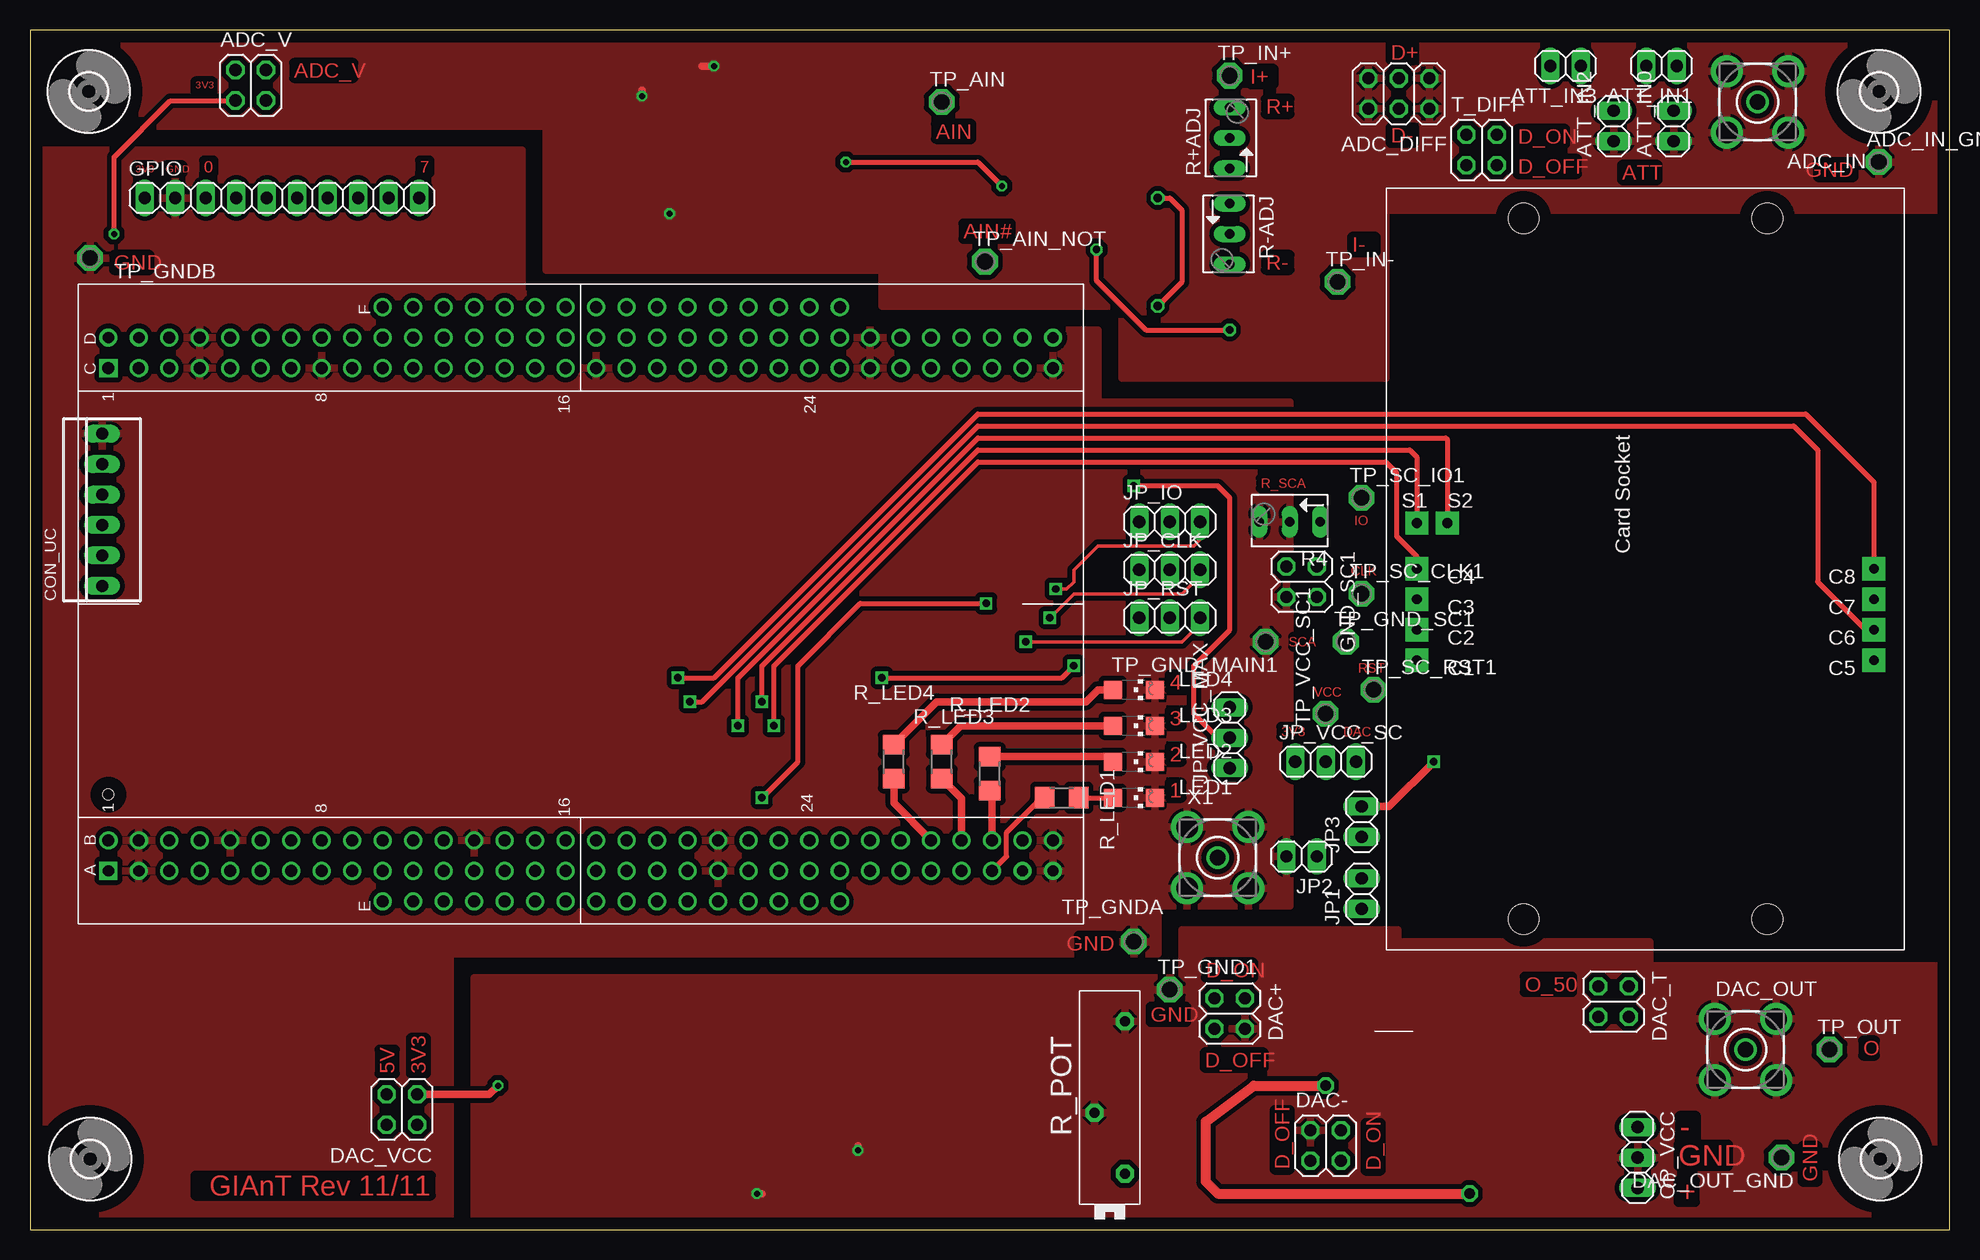
[diagram p4: board, top side]
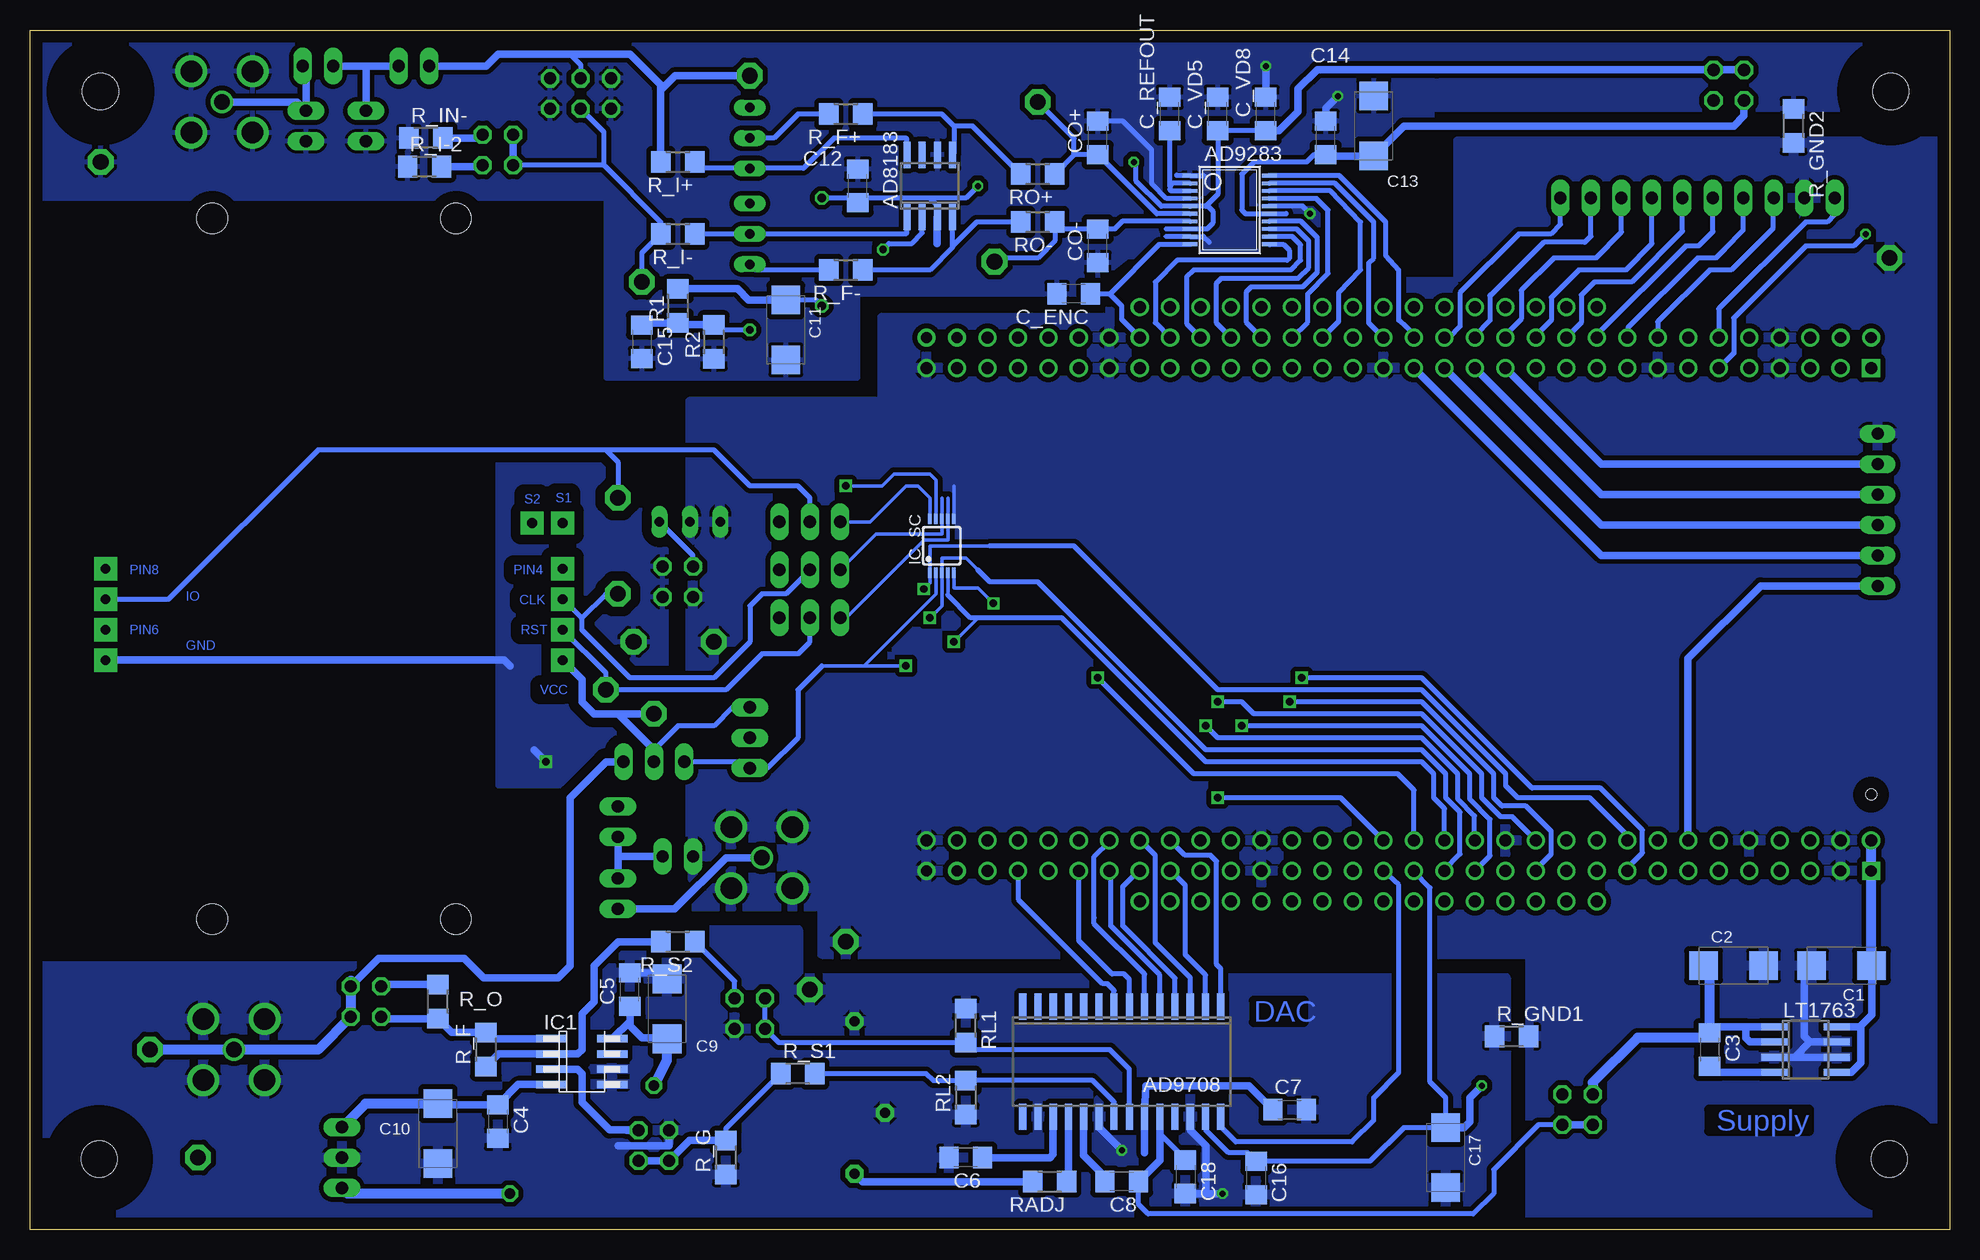
[diagram p5: board, bottom side, seen from below]

Size 160 x 100 mm. Coordinates in mm from the lower left corner, seen from the top.
Outline: 0,0 160,0 160,100 0,100 0,0
Copper layers (1*16): Top 0.035mm / dielectric 1.5mm / Bottom 0.035mm
Design rules "default": minimum track width 10mil, minimum drill 24mil, track to track 8mil, track to pad 8mil, pad to pad 8mil, via to via 8mil, smd to smd 8mil, copper to edge 40mil, drill to drill 8mil, minimum pad ring 10mil, minimum via ring 8mil, stop-mask expansion 4mil, vias tented up to drill 0mil, thermal gap 10mil

### Footprints (pad centres in the part's own frame; a part is rotated, then mirrored left to right if it is on the bottom)
SOIC8 = smd 0.6 x 2.2: 1 -1.905,-2.6; 2 -0.635,-2.6; 3 0.635,-2.6; 4 1.905,-2.6; 5 1.905,2.6; 6 0.635,2.6; 7 -0.635,2.6; 8 -1.905,2.6
SSOP20 = smd 0.305 x 1.245: 1 -2.857,-3.302; 2 -2.222,-3.302; 3 -1.587,-3.302; 4 -0.952,-3.302; 5 -0.317,-3.302; 6 0.318,-3.302; 7 0.953,-3.302; 8 1.588,-3.302; 9 2.223,-3.302; 10 2.858,-3.302; 11 2.858,3.302; 12 2.223,3.302; 13 1.588,3.302; 14 0.953,3.302; 15 0.318,3.302; 16 -0.317,3.302; 17 -0.952,3.302; 18 -1.587,3.302; 19 -2.222,3.302; 20 -2.857,3.302
SO28W = smd 0.6 x 2.2: 1 -8.255,-4.6; 2 -6.985,-4.6; 3 -5.715,-4.6; 4 -4.445,-4.6; 5 -3.175,-4.6; 6 -1.905,-4.6; 7 -0.635,-4.6; 8 0.635,-4.6; 9 1.905,-4.6; 10 3.175,-4.6; 11 4.445,-4.6; 12 5.715,-4.6; 13 6.985,-4.6; 14 8.255,-4.6; 15 8.255,4.6; 16 6.985,4.6; 17 5.715,4.6; 18 4.445,4.6; 19 3.175,4.6; 20 1.905,4.6; 21 0.635,4.6; 22 -0.635,4.6; 23 -1.905,4.6; 24 -3.175,4.6; 25 -4.445,4.6; 26 -5.715,4.6; 27 -6.985,4.6; 28 -8.255,4.6
2X03 = drill 1.016 octagon: 1 -2.54,-1.27; 2 -2.54,1.27; 3 0,-1.27; 4 0,1.27; 5 2.54,-1.27; 6 2.54,1.27
BU-SMA-V = drill 1.27 round: 1 0,0 | drill 1.778 round: 2 -2.55,2.55; 3 2.55,2.55; 4 2.55,-2.55; 5 -2.55,-2.55
P1-13 = drill 1.321 pad 2.159 octagon: TP 0,0
2X02 = drill 1.016 octagon: 1 -1.27,-1.27; 2 -1.27,1.27; 3 1.27,-1.27; 4 1.27,1.27
1X02 = drill 1.016 long: 1 -1.27,0; 2 1.27,0
SMC_C = smd 2.4 x 2.4: + -2.5,0; - 2.5,0
C1206 = smd 1.6 x 1.8: 1 -1.4,0; 2 1.4,0
USB-FPGA1.11 = drill 0.925 pad 1.5 square: A1 2.54,1.905 | drill 0.925 pad 1.5 round: A2 5.08,1.905; A31 78.74,1.905; A32 81.28,1.905; D1 2.54,46.355; D2 5.08,46.355; D31 78.74,46.355; D32 81.28,46.355 | drill 1 pad 1.5 round: A3 7.62,1.905; A4 10.16,1.905; A5 12.7,1.905; A6 15.24,1.905; A7 17.78,1.905; A8 20.32,1.905; A9 22.86,1.905; A10 25.4,1.905; A11 27.94,1.905; A12 30.48,1.905; A13 33.02,1.905; A14 35.56,1.905; A15 38.1,1.905; A16 40.64,1.905; A17 43.18,1.905; A18 45.72,1.905; A19 48.26,1.905; A20 50.8,1.905; A21 53.34,1.905; A22 55.88,1.905; A23 58.42,1.905; A24 60.96,1.905; A25 63.5,1.905; A26 66.04,1.905; A27 68.58,1.905; A28 71.12,1.905; A29 73.66,1.905; A30 76.2,1.905; B1 2.54,4.445; B2 5.08,4.445; B3 7.62,4.445; B4 10.16,4.445; B5 12.7,4.445; B6 15.24,4.445; B7 17.78,4.445; B8 20.32,4.445; B9 22.86,4.445; B10 25.4,4.445; B11 27.94,4.445; B12 30.48,4.445; B13 33.02,4.445; B14 35.56,4.445; B15 38.1,4.445; B16 40.64,4.445; B17 43.18,4.445; B18 45.72,4.445; B19 48.26,4.445; B20 50.8,4.445; B21 53.34,4.445; B22 55.88,4.445; B23 58.42,4.445; B24 60.96,4.445; B25 63.5,4.445; B26 66.04,4.445; B27 68.58,4.445; B28 71.12,4.445; B29 73.66,4.445; B30 76.2,4.445; B31 78.74,4.445; B32 81.28,4.445; C2 5.08,43.815; C3 7.62,43.815; C4 10.16,43.815; C5 12.7,43.815; C6 15.24,43.815; C7 17.78,43.815; C8 20.32,43.815; C9 22.86,43.815; C10 25.4,43.815; C11 27.94,43.815; C12 30.48,43.815; C13 33.02,43.815; C14 35.56,43.815; C15 38.1,43.815; C16 40.64,43.815; C17 43.18,43.815; C18 45.72,43.815; C19 48.26,43.815; C20 50.8,43.815; C21 53.34,43.815; C22 55.88,43.815; C23 58.42,43.815; C24 60.96,43.815; C25 63.5,43.815; C26 66.04,43.815; C27 68.58,43.815; C28 71.12,43.815; C29 73.66,43.815; C30 76.2,43.815; C31 78.74,43.815; C32 81.28,43.815; D3 7.62,46.355; D4 10.16,46.355; D5 12.7,46.355; D6 15.24,46.355; D7 17.78,46.355; D8 20.32,46.355; D9 22.86,46.355; D10 25.4,46.355; D11 27.94,46.355; D12 30.48,46.355; D13 33.02,46.355; D14 35.56,46.355; D15 38.1,46.355; D16 40.64,46.355; D17 43.18,46.355; D18 45.72,46.355; D19 48.26,46.355; D20 50.8,46.355; D21 53.34,46.355; D22 55.88,46.355; D23 58.42,46.355; D24 60.96,46.355; D25 63.5,46.355; D26 66.04,46.355; D27 68.58,46.355; D28 71.12,46.355; D29 73.66,46.355; D30 76.2,46.355; E10 25.4,-0.635; E11 27.94,-0.635; E12 30.48,-0.635; E13 33.02,-0.635; E14 35.56,-0.635; E15 38.1,-0.635; E16 40.64,-0.635; E17 43.18,-0.635; E18 45.72,-0.635; E19 48.26,-0.635; E20 50.8,-0.635; E21 53.34,-0.635; E22 55.88,-0.635; E23 58.42,-0.635; E24 60.96,-0.635; E25 63.5,-0.635; F10 25.4,48.895; F11 27.94,48.895; F12 30.48,48.895; F13 33.02,48.895; F14 35.56,48.895; F15 38.1,48.895; F16 40.64,48.895; F17 43.18,48.895; F18 45.72,48.895; F19 48.26,48.895; F20 50.8,48.895; F21 53.34,48.895; F22 55.88,48.895; F23 58.42,48.895; F24 60.96,48.895; F25 63.5,48.895 | drill 1 pad 1.5 square: C1 2.54,43.815 | hole 0.9: 2.54,8.255
22-23-2061 = drill 1 long: 1 -6.35,0; 2 -3.81,0; 3 -1.27,0; 4 1.27,0; 5 3.81,0; 6 6.35,0
1X10 = drill 1.016 long: 1 -11.43,0; 2 -8.89,0; 3 -6.35,0; 4 -3.81,0; 5 -1.27,0; 6 1.27,0; 7 3.81,0; 8 6.35,0; 9 8.89,0; 10 11.43,0
3,0 = hole 3: 0,0
SO08 = smd 0.635 x 2.54: 1 -1.905,-2.54; 2 -0.635,-2.54; 3 0.635,-2.54; 4 1.905,-2.54; 5 1.905,2.54; 6 0.635,2.54; 7 -0.635,2.54; 8 -1.905,2.54
UMAX10 = smd 0.32 x 0.9: 1 -1,-2.25; 2 -0.5,-2.25; 3 0,-2.25; 4 0.5,-2.25; 5 1,-2.25; 6 1,2.25; 7 0.5,2.25; 8 0,2.25; 9 -0.5,2.25; 10 -1,2.25
1X03 = drill 1.016 long: 1 -2.54,0; 2 0,0; 3 2.54,0
CHIPLED_1206 = smd 1.5 x 1.5: A 0,-1.75; C 0,1.75
R1206 = smd 1.6 x 1.803: 1 -1.422,0; 2 1.422,0
B64Y = drill 0.813 long: A 2.54,0; E -2.54,0; S 0,0
PT-SPIN = drill 0.813 pad 1.524 octagon: 1 -6.35,-1.27; 2 6.35,-1.27; 3 -1.27,1.27
CARDSOCKET = drill 0.813 pad 1.93 square: CLK -25.4,2.54; GND 12.7,-2.54; I/O 12.7,2.54; PIN4 -25.4,5.08; PIN6 12.7,0; PIN8 12.7,5.08; RST -25.4,0; SW1 -25.4,8.89; SW2 -22.86,8.89; VCC -25.4,-2.54 | hole 2.54: 3.81,34.29; -16.51,34.29; 3.81,-24.13; -16.51,-24.13

### Placement (x,y rotation side)
AD8183  85,87 0 bottom
AD9283  60,85 270 bottom
AD9708  69,14 180 bottom
ADC_DIFF  114.1,94.7 0 top
ADC_IN  144,94 0 top
ADC_IN_GND  154.1,89 0 top
ADC_V  18.4,95.4 0 top
ATT_IN0  137,92 90 top
ATT_IN1  136,97 180 top
ATT_IN2  132,92 90 top
ATT_IN3  128,97 180 top
C1  9,22 180 bottom
C2  18,22 0 bottom
C3  20,15 270 bottom
C4  121,9 270 bottom
C5  110,20 90 bottom
C6  82,6 180 bottom
C7  55,10 0 bottom
C8  69,4 180 bottom
C9  106.9,18.4 90 bottom
C10  126,8 90 bottom
C11  97,75 270 bottom
C12  91,87 90 bottom
C13  48,92 90 bottom
C14  52,91 90 bottom
C15  109,74 270 bottom
C16  57.8,4.3 270 bottom
C17  42,6 270 bottom
C18  63.7,4.4 270 bottom
C_ENC  73,78 180 bottom
C_REFOUT  65,93 90 bottom
C_VD5  61,93 90 bottom
C_VD8  57,93 90 bottom
CO+  71,91 90 bottom
CO-  71,82 90 bottom
CON1  4,28 0 top
CON_UC  6,60 90 top
DAC+  100,18 270 top
DAC-  108,7 0 top
DAC_OUT  143,15 0 top
DAC_OUT_GND  146,6 180 top
DAC_T  132,19 270 top
DAC_VCC  31,10 180 top
GND_SC1  106,54 270 top
GPIO  21,86 0 top
H1  4.9,94.88 0 top
H2  5.01,5.88 0 top
H3  154.12,94.88 0 top
H4  154.23,5.88 0 top
IC1  114,14 270 bottom
IC_SC  84,57 0 bottom
JP1  111,28 90 top
JP2  106,31.1 180 top
JP3  111,34 90 top
JP_CLK  95,55 0 top
JP_IO  95,59 0 top
JP_RST  95,51 0 top
JP_VCC_MAX  100,41 90 top
JP_VCC_SC  108,39 0 top
LED1  92,36 270 top
LED2  92,39 270 top
LED3  92,42 270 top
LED4  92,45 270 top
LT1763  12,15 270 bottom
OP_VCC  134,6 270 top
R1  106,77 90 bottom
R2  103,74 90 bottom
R4  105,59 180 top
R+ADJ  100,91 90 top
R-ADJ  100,83 270 top
R_F  122,15 90 bottom
R_F+  92,93 180 bottom
R_F-  92,80 180 bottom
R_G  102,6 90 bottom
R_GND1  36.5,16.1 0 bottom
R_GND2  13,92 270 bottom
R_I+  106,89 180 bottom
R_I-  106,83 180 bottom
R_I-2  127.1,88.6 0 bottom
R_IN-  127,91 0 bottom
R_LED1  86,36 180 top
R_LED2  80,38 270 top
R_LED3  76,39 270 top
R_LED4  72,39 270 top
R_O  126,19 270 bottom
R_POT  90,11 90 top
R_S1  96,13 0 bottom
R_S2  106,24 180 bottom
RADJ  75,4 180 bottom
RL1  82,17 270 bottom
RL2  82,11 90 bottom
RO+  76,88 180 bottom
RO-  76,84 180 bottom
T_DIFF  121,90 0 top
TP_AIN  76,94 0 top
TP_AIN_NOT  79.6,80.7 0 top
TP_GND1  95,20 0 top
TP_GND_MAIN1  103,49 180 top
TP_GND_SC1  109.7,49 0 top
TP_GNDA  92,24 0 top
TP_GNDB  5,81 0 top
TP_IN+  100,96.2 0 top
TP_IN-  109,79 0 top
TP_OUT  150,15 0 top
TP_SC_CLK1  111,53 0 top
TP_SC_IO1  111,61 0 top
TP_SC_RST1  112,45 0 top
TP_VCC_SC1  108,43 90 top
U$2  141,50 0 top
X1  99,31 0 top

### Tracks (layer width: path | path; a pad name or v marks a point on that pad's centre or on a via)
+3V3  (via drill 0.5 pad 0.61, 0.7)
  Top 0.406: v94,86 95,86 96,85 96,79 v94,77 | v68,89 79,89 v81,87
  Bottom 0.406: 62,85.3 61.8,85.3 61.4,84.9 61.4,83.9 61.89,83.41 AD9283.8 65.3,83.41 65.3,83.4 | 62,85.3 63.28,85.3 AD9283.5 63.32,85.3 65.7,85.3 67.8,87.4 67.8,88.8 v68,89 | C_VD8.1 C_VD5.1 61,86.3 62,85.3 | AD8183.3 84.36,85.36 85,86 | 85,86 90.6,86 | C12.1 91,86 v94,86 | v94,77 94.5,77.5 C11.+ | 85,86 82,86 v81,87
  Bottom 0.61: C_VD8.1 55.9,91.6 54.3,93.2 54.3,95.1 52.7,96.7 42.8,96.7 42.77,96.67 ADC_V.4 ADC_V.2 | 90.6,86 C12.1 | R1.2 101.02,78.42 100.1,77.5 C11.+ | AD8183.3 84.4,84.4 84.4,82.2
+5V
  Bottom 0.61: 17,16.91 LT1763.1 | 17,16.91 19.5,16.91 C3.1 | LT1763.2 16.64,15.63 17,16 17,16.91
  Bottom 0.813: C2.+ 20,22 C3.1 20.4,16 26,16 29.73,12.27 DAC_VCC.3
+5V/1  (via drill 0.5 pad 0.61)
  Top 0.61: DAC_VCC.1 38.27,11.27 v39,12
  Bottom 0.406: CON1.A16 44.64,29.84 43.3,28.5 43.3,12.3 42,11 C17.+ 45.5,8.5 48.3,5.7 C16.1 58.5,6.4 60.1,6.4 62.02,8.31 AD9708.27
  Bottom 0.61: v39,12 40,11 40,9 40.5,8.5 C17.+
+5V/2
  Bottom 0.406: CON1.D6 19.24,76.76 12,84 10.2,84 9.6,84.6 9.6,86.97 GPIO.1
+5V/3  (via drill 0.5 pad 0.61)
  Top 0.406: v7,83 7,89.4 11.7,94.1 17.1,94.1 ADC_V.1
  Bottom 0.406: CON1.C6 18.05,73 18,73 18,76 12,82 8,82 v7,83 | C14.1 53,89.6 53.6,89 58,89 59,88 59,85 58.68,84.68 AD9283.15 55.3,84.68 55.3,84.7 | ADC_V.1 17.13,93.13
  Bottom 0.61: C14.1 51.9,89.5 C13.+ 45.5,92 18,92 17.13,92.87 ADC_V.1
ADC_AIN
  Bottom 0.406: 72.98,89.6 CO+.1 66.08,84.68 AD9283.6 | 72.98,89.6 RO+.1 | 72.98,89.6 72.98,90.98 TP_AIN.TP
ADC_AIN_NOT
  Bottom 0.406: AD9283.7 68.95,84.05 69.6,83.4 CO-.2 73.98,83.4 RO-.1 74.58,82.42 76,81 79.3,81 TP_AIN_NOT.TP
ADC_D0
  Bottom 0.406: AD9283.20 50.86,87.86 47,84 47,81.2 45.9,80 45.9,75.8 44.64,74.64 CON1.D16
ADC_D1
  Bottom 0.406: AD9283.19 51.22,87.22 48,84 48,81 48.4,80.6 48.4,75.58 CON1.D17
ADC_D2
  Bottom 0.406: AD9283.18 51.59,86.59 49.1,84 49.1,80 50.9,78.1 50.9,75.72 CON1.D19
ADC_D4
  Bottom 0.406: AD9283.14 54.05,84.05 52.7,82.7 52.7,79.8 53.9,78.6 54.3,78.6 58.2,78.6 58.6,78.2 58.6,75.61 CON1.D21
ADC_D5
  Bottom 0.406: AD9283.13 54.41,83.41 53.4,82.4 53.4,80.2 54.3,79.3 60.7,79.3 61.1,78.9 61.1,75.58 CON1.D22
ADC_D6
  Bottom 0.406: AD9283.12 54.78,82.78 54.1,82.1 54.1,80.8 54.9,80 63,80 63.6,79.4 63.6,75.53 CON1.D23
ADC_D7
  Bottom 0.406: AD9283.11 56.66,82.1 55.5,82.1 55,81.6 55,81 55.2,80.8 64.4,80.8 66.2,79 66.2,75.59 CON1.D24
ADC_ENCODE
  Bottom 0.406: CON1.D25 69,75.86 69,77 70,78 | AD9283.10 65.86,82.14 70,78 | 70,78 C_ENC.1
CLK
  Bottom 0.406: CON1.A17 45.9,28.73 45.9,13.1 48,11 48,9.1 49.8,7.3 59.5,7.3 60.74,8.54 AD9708.28
CLK_SC  (via drill 0.6)
  Top 0.305: JP_CLK.3 97.54,54.54 96,53 87,53 v85,51
  Bottom 0.305: 81,55 82,56 84,56 IC_SC.3 84,52 v85,51
  Bottom 0.406: CON1.A15 42.1,30 40.8,31.3 40.8,34.8 42,36 42,38 44,40 62,40 76,54 80,54 81,55
DAC_AVCC
  Bottom 0.406: C18.1 63.7,5.88 65.83,8 | DAC_VCC.2 34.27,8.73 38,5 38,3 39.7,1.3 66.8,1.3 67.6,2.1 C8.1
  Bottom 0.61: AD9708.24 65.83,8 65.83,5.78 C8.1 | DAC_VCC.4 DAC_VCC.2
DAC_OUT_V_NET
  Bottom 0.61: DAC_T.2 130.94,22.6 123.8,22.6 122.2,21 116,21 115,22 115,36 112,39 JP_VCC_SC.3
  Bottom 0.813: 133.27,20.73 DAC_T.2 DAC_T.4 136,15 DAC_OUT.1 TP_OUT.TP
DB0
  Bottom 0.406: CON1.A29 77.6,29.84 77.6,27.5 70.6,20.5 70.2,20.5 69.64,19.93 AD9708.8
DB1
  Bottom 0.406: CON1.A27 72.58,24.08 69.8,21.3 68.8,21.3 68.36,20.86 AD9708.7
DB2
  Bottom 0.406: CON1.B26 70.04,32.36 71.3,31.1 71.3,26 71.3,25.5 67.09,21.3 AD9708.6
DB3
  Bottom 0.406: CON1.A26 69.9,29.77 69.9,25.3 65.83,21.23 AD9708.5
DB4
  Bottom 0.406: CON1.A25 67.59,29.91 68.9,28.6 68.9,25.3 64.56,20.95 AD9708.4
DB5
  Bottom 0.406: CON1.B25 67.44,32.45 66.2,31.2 66.2,23.9 63.28,20.98 AD9708.3
DB6
  Bottom 0.406: CON1.A24 64.91,29.91 63.7,28.7 63.7,22.9 62.02,21.21 AD9708.2
DB7
  Bottom 0.406: CON1.B24 63.72,31.2 61.6,31.2 61.1,30.7 61.1,22.1 60.74,21.75 AD9708.1
GND
  Bottom 0.305: IC_SC.6 83,62
  Bottom 0.61: 11.63,15.63 LT1763.7 | 11.63,15.63 12.1,16.1 12.1,21.4 C1.- | 12.9,14.37 LT1763.3 | 12.9,14.37 11.63,15.63 | LT1763.6 12.9,14.37
  pour Bottom (isolate 0.406): 0,1 0,90.7 41,90.7 41,79 70,79 70,76 89,76 89,69 105,69 105,27 94,27 94,23 35,23 35,1
  pour Top (isolate 0.406): 1,90 41,90 41,78 69,78 69,75 89,75 89,69 105,69 105,27 94,27 94,23 35,23 35,1 1,1
GND1  (via drill 0.5 pad 0.61)
  Top 0.61: v60.6,3 61,3 | v69,6.6 69,7
  Bottom 0.61: DAC-.2 106.73,7 111,7 | v60.6,3 62,3 | 62,3 C18.2 | AD9708.26 63.28,8.29 62,7 62,3 | AD9708.20 70.91,8.51 v69,6.6 | C5.2 107.4,21.4 C9.-
  pour Bottom (isolate 0.406): 37,21 37,1 159,1 159,22 113,22 113,25 96,25 96,21
  pour Top (isolate 0.406): 37,21 37,1 159,1 159,22 135,22 135,24 114,24 114,25 96,25 96,21
GND2  (via drill 0.5 pad 0.61)
  Top 0.61: v57,97 56,97 | v51,94.5 51,95
  Bottom 0.406: AD9283.4 65.25,85.95 66.5,87.2 66.5,90 68.9,92.4 CO+.2 | AD9283.16 53.92,85.32 v53.3,84.7 | 61.7,82.3 62.18,82.78 AD9283.9 65.3,82.78 65.3,82.8 | 62.1,87.8 62.16,87.86 AD9283.1 64.4,87.86 64.4,87.9
  Bottom 0.61: C_VD8.2 v57,97 | C14.2 52,93.5 v51,94.5
  pour Bottom (isolate 0.406): 0,100 160,100 160,86 112,86 112,71 91,71 91,78 72.5,78 68.5,81.1 43.1,81.1 43.1,93.4 0,93.4
  pour Top (isolate 0.406): 6,100 6,92 43,92 43,80 71,80 71,77 91,77 91,71 113,71 113,85 160,85 160,100
GND_SMARTCARD1  (via drill 0.6)
  Top 0.61: JP3.2 113.27,35.27 v117,39
  Bottom 0.61: v117,39 118,40 | U$2.GND 120.46,47.46 120,47
  pour Bottom (isolate 0.813): 107,69 107,37 121,37 121,69
IO  (via drill 0.6)
  Top 0.305: JP_IO.3 97.54,57.54 97,57 89,57 87,55 87,54 86.4,53.4 v85.5,53.4
  Bottom 0.305: 80,57 85,57 IC_SC.1 85,53.9 v85.5,53.4
  Bottom 0.406: CON1.B9 26.86,32.86 30,36 36,36 37,37 37,38 44,45 61,45 73,57 80,57
N$7
  Bottom 0.61: LT1763.4 19.5,13.1 C3.2
N$10
  Bottom 0.406: R_G.2 102,8.42 R_S1.1
  Bottom 0.61: R_G.2 105.04,7.42 DAC-.1 DAC-.3
N$11
  Bottom 0.61: R_F.1 120.94,14.63 IC1.2 114.36,14.63 114,15 114,18 113,19 113,22 111,24 R_S2.2
N$12
  Bottom 0.61: IC1.1 121.48,15.9 R_F.2 124.84,16.42 R_O.2 130.58,17.58 DAC_T.3
N$13
  Bottom 0.61: AD9708.17 74.72,6.29 75,6 C6.1
N$14
  Bottom 0.61: C7.1 58.4,12 67,12 67.09,9.9 AD9708.23 67.1,6.4
N$15
  Bottom 0.61: AD9708.19 72.17,6.17 70.4,4.4 C8.2
N$16
  Bottom 0.61: AD9708.18 73.44,4.13 RADJ.1
N$17
  Bottom 0.61: 110.27,8.27 DAC-.4 109.3,8.3 111.7,8.3 114,10.6 114,13 114.36,13.37 IC1.3
N$18
  Bottom 0.61: R_O.1 130.58,20.42 DAC_T.1
N$19
  Bottom 0.61: RADJ.2 90.62,4 R_POT.1
N$20  (via drill 0.6)
  Top 0.406: JP_VCC_MAX.2 99,41 97,43 97,47 100,50 100,61 99,62 v92,62
  Bottom 0.305: IC_SC.9 84.5,62.5 85,63 88,63 89,62 v92,62
N$22
  Bottom 0.406: AD9708.21 69.64,10.63 71.42,12.42 RL2.2 82.02,12.4 84.7,12.4 85.3,13 R_S1.2
N$23
  Bottom 0.406: AD9708.22 68.36,13.37 70,15 81.42,15 RL1.2 97.58,15.58 DAC+.3 DAC+.1
N$24
  Bottom 0.406: 101.27,19.85 101.27,20.69 R_S2.1
  Bottom 0.61: DAC+.2 101.27,19.85
N$25
  Bottom 0.406: CON1.D8 24.32,75.68 20,80 18.2,80 14.7,83.5 14.7,86.95 GPIO.3
N$26
  Bottom 0.406: GPIO.4 17.19,83.31 18.75,81.75 | 18.75,81.75 19,81.5 | CON1.D9 26.8,74.42 26.8,75.2 21,81 19.5,81 18.75,81.75
N$27
  Bottom 0.406: CON1.D10 29.4,74.6 22,82 20.93,82 19.73,83.2 | 19.73,83.2 GPIO.5 | 19.73,83.2 19.7,83.2
N$28
  Bottom 0.406: GPIO.6 22.27,83.23 26.5,79 29.6,79 30.7,77.9 30.7,75.59 CON1.D11
N$29
  Bottom 0.406: CON1.D12 34.48,74.52 33.2,75.8 33.2,77.7 30.9,80 27,80 24.81,82.19 GPIO.7
N$30
  Bottom 0.406: GPIO.8 27.35,83.15 29.5,81 33,81 35.7,78.3 35.7,75.9 37.02,74.58 CON1.D13
N$31
  Bottom 0.406: CON1.D14 39.56,74.54 38.3,75.8 38.3,77.8 | 38.3,77.8 38.3,77.9 | GPIO.9 29.89,82.81 30.4,82.3 33.8,82.3 38.3,77.8
N$32
  Bottom 0.406: GPIO.10 32.43,83.8 33.23,83 35.9,83 40.8,78.1 40.8,75.3 41.74,74.36 CON1.D15
N$33
  Bottom 0.406: AD9283.2 64.78,87.22 65,87 | 65,87 65,86.7 64.89,86.59 AD9283.3 | 65,87 C_REFOUT.1
N$34
  Top 0.61: R_LED2.1 89.83,39.42 LED2.A
N$35
  Top 0.406: R_LED1.1 LED1.A
N$36
  Bottom 0.406: 104.04,88.46 R+ADJ.E 95.54,88.46 93,91 87,91 86.91,90.91 AD8183.8
  Bottom 0.61: 104.04,88.46 R_I+.1
N$37
  Bottom 0.406: AD8183.1 86.91,83.09 87,83 R-ADJ.S R_I-.1
N$38
  Bottom 0.61: ATT_IN2.2 132,97 | 132,97 ATT_IN1.2 | 132,97 ATT_IN3.1
N$39
  Bottom 0.406: 112.15,88.73 T_DIFF.1 | 112.15,88.73 107.42,84 R_I-.2 109,81.42 TP_IN-.TP | 112.15,88.73 112.15,91.48 ADC_DIFF.3
  Bottom 0.61: T_DIFF.1 T_DIFF.2
N$40
  Bottom 0.61: R_I-2.2 122.4,88.6 T_DIFF.3
N$41
  Bottom 0.61: R_IN-.2 122.54,91 T_DIFF.4
N$42
  Bottom 0.406: ADC_DIFF.4 114.1,97.1 115,98
  Bottom 0.61: 107.42,95 R_I+.2 | 107.42,95 107.42,95.42 110,98 115,98 121,98 122,97 ATT_IN3.2 | TP_IN+.TP 106.22,96.2 107.42,95
N$43
  Bottom 0.406: R_F-.2 99.54,80 R-ADJ.A
N$44
  Bottom 0.406: R+ADJ.S 98,91 96,93 R_F+.2
N$45
  Bottom 0.406: R_F+.1 84,93 83,92 | AD8183.5 arc-90 83,89.69 83,92 | RO+.2 81.42,92 83,92
N$46
  Bottom 0.406: 83.09,82 83.09,81.91 85,80 R_F-.1 | 83.09,82 AD8183.4 | RO-.2 81.09,84 83.09,82
N$47
  Bottom 0.305: 84,61 IC_SC.8 84,58 89.46,58 JP_CLK.1
N$49
  Bottom 0.406: CON1.D20 53.5,75.66 53.5,78 51.8,79.7 51.8,85 52.75,85.95 AD9283.17
N$50
  Top 0.61: LED3.A 77.58,42 R_LED3.1
N$51
  Top 0.61: LED4.A 89,45 88,44 75.58,44 R_LED4.1
N$53
  Top 0.406: 80.2,36.38 R_LED2.2
  Top 0.61: CON1.B30 80.2,36.38
N$54
  Top 0.406: CON1.A30 81.4,31.1 81.4,33.1 84,35.7
  Top 0.61: 84,35.7 84.28,35.7 R_LED1.2
N$55
  Top 0.61: CON1.B29 77.66,35.92 R_LED3.2
N$56
  Top 0.406: 72,37 R_LED4.2
  Top 0.61: 72,37 72,35.56 CON1.B28
N$57
  Bottom 0.406: JP_VCC_MAX.3 101.46,43.54 103,42 106,42 108,40
  Bottom 0.61: JP_VCC_SC.2 108,40 111,43 | 111,43 113,43 114,44 114,45.86 U$2.VCC | 111,43 TP_VCC_SC1.TP
N$58
  Bottom 0.61: CON_UC.1 15.75,53.65 21.8,47.6 21.8,32.47 CON1.B7
N$59
  Bottom 0.305: IC_SC.10 85,61 86,62 87,62 90,59 JP_IO.1
N$60
  Bottom 0.61: CON_UC.5 29.02,63.81 CON1.C13
N$61
  Bottom 0.61: CON_UC.4 29.02,61.27 CON1.C14
N$62
  Bottom 0.61: CON_UC.3 29.02,58.73 CON1.C15
N$63
  Bottom 0.61: CON_UC.2 29.02,56.19 CON1.C16
N$64
  Bottom 0.406: GND_SC1.1 104.73,56.19 R4.E
N$65
  Bottom 0.305: 83.5,61 IC_SC.7 83.5,57.5 85.5,57.5 92,51 JP_RST.1
N$66
  Bottom 0.61: JP1.1 106.27,26.73 102,31 X1.1
N$67
  Bottom 0.61: JP1.2 111,31 111,31.1 | 111,31.1 JP3.1 | JP2.1 111,31.1
N$68
  Bottom 0.61: ADC_IN.1 137.73,94 ATT_IN0.2 137,96.73 ATT_IN1.1
PIN4  (via drill 0.6)
  Top 0.406: v62,42 62,47 79,64 113,64 113.9,63.1 113.9,57.8 115.6,56.1 U$2.PIN4
  Bottom 0.406: CON1.B14 39.6,32.48 39.6,34.5 41,35.9 41,38 44,41 61,41 v62,42
PIN6  (via drill 0.6)
  Top 0.406: U$2.PIN6 153,50 149,54 149,65 147,67 79,67 56,44 v55,44
  Bottom 0.406: CON1.A12 34.48,30.02 33.2,31.3 33.2,33.2 35.3,35.3 37.3,35.3 38,36 38,38 44,44 v55,44
PIN8  (via drill 0.6)
  Top 0.406: U$2.PIN8 153.7,62.3 148,68 79,68 57,46 v54,46
  Bottom 0.406: CON1.A9 26.86,30.14 25.6,31.4 25.6,33.3 29.1,36.8 34.8,36.8 44,46 v54,46
RST  (via drill 0.6)
  Top 0.305: JP_RST.3 97.54,50.54 96,49 v83,49
  Bottom 0.305: 83.5,52.9 IC_SC.4 | 81,51 v83,49
  Bottom 0.406: CON1.B15 42.1,35.1 43,36 43,38 44,39 62,39 74,51 81,51 81.6,51 83.5,52.9
SC_CLK_PIN
  Bottom 0.406: JP_CLK.2 97,53 99,53 100,52 100,49 103,46 110,46 114,50 114,50.94 114.03,50.97 | 114.03,50.97 U$2.CLK | TP_SC_CLK1.TP 112,53 114.03,50.97
SC_IO_PIN
  Bottom 0.406: U$2.I/O 148.46,52.54 136,65 112,65 | 112,65 103,65 100,62 96,62 95,61 JP_IO.2 | TP_SC_IO1.TP 111,64 112,65
SC_RST_PIN
  Bottom 0.406: JP_RST.2 95,49 96,48 99,48 102,45 TP_SC_RST1.TP 112,46.4 U$2.RST
SHDN  (via drill 0.6)
  Top 0.406: v79.7,52.2 69.2,52.2 64,47 64,39 v61,36
  Bottom 0.305: IC_SC.5 83,53.5 81,53.5 v79.7,52.2
  Bottom 0.406: v61,36 50.73,36 CON1.B17
SW1  (via drill 0.6)
  Top 0.406: U$2.SW1 115.6,64.4 115,65 79,65 61,47 v61,44
  Bottom 0.406: CON1.B12 36.44,34.4 37.4,34.4 39,36 39,38 44,43 58,43 59,44 v61,44
SW2  (via drill 0.6)
  Top 0.406: U$2.SW2 118.14,65.86 118,66 79,66 59,46 v59,42
  Bottom 0.406: CON1.A14 38.3,31.16 38.3,34.2 40,35.9 40,38 44,42 v59,42
V+  (via drill 0.9)
  Top 0.813: v120,3 99,3 98,4 98,9 102,12 v108,12
  Bottom 0.61: IC1.8 110,17.36 110,18 | 110,18 C5.1 | C9.+ 107,16 109,16 110,17 110,18
  Bottom 0.813: v120,3 133.54,3 OP_VCC.3 | v108,12 106.9,14.1 C9.+
V-
  Bottom 0.61: IC1.4 119.31,12.1 C4.1 125.9,10.4 C10.-
  Bottom 0.813: OP_VCC.1 132.04,10.5 C10.-
V_15  (via drill 0.6)
  Top 0.406: v88.9,81.7 88.9,79.1 93,75 v100,75
  Bottom 0.406: AD8183.2 85.64,83.06 86.5,82.2 88.4,82.2 v88.9,81.7 | v100,75 102.58,75 R2.2
  Bottom 0.61: R2.2 105.84,75.42 R1.1 108.82,75.58 C15.1
VEE
  Bottom 0.61: 7.5,16.91 LT1763.8 | 7.5,16.91 6.5,17.9 C1.+ | LT1763.5 8.21,13.1 7.4,13.9 7.4,16.81 7.5,16.91
  Bottom 0.813: CON1.B1 CON1.A1 6.54,22 C1.+
VPP  (via drill 0.6)
  Top 0.406: v71,46 86,46 v87,47
  Bottom 0.305: IC_SC.2 84.5,53 90.5,47 | 90.5,47 91,47 94,47 | v87,47 90.5,47
  Bottom 0.406: JP_VCC_SC.1 100.54,39 JP_VCC_MAX.1 98.54,38.46 96,41 96,45 94,47 | CON1.B16 44.64,36.64 46,38 63,38 v71,46

### Text on the board
Top: D+ | ADC_V | I+ | 3V3 | R+ | AIN | D- | D_ON | GND | 3V3 | GND | 0 | 7 | D_OFF | ATT | AIN# | I- | GND | R- | R_SCA | IO | CLK | SCA | RST | 4 | VCC | 3 | DAC | 3V3 | 2 | 1 | GND | D_ON | O_50 | GND | D_OFF | O | 5V | 3V3 | - | D_OFF | D_ON | GND | GIAnT Rev 11/11 | GND | +
Bottom: S1 | S2 | PIN4 | PIN8 | CLK | IO | RST | PIN6 | GND | VCC | DAC | Supply